# EAGLE design STHV800_pulser_board_v10 (EAGLE 9.6.2)

## Sheet 1 of 2
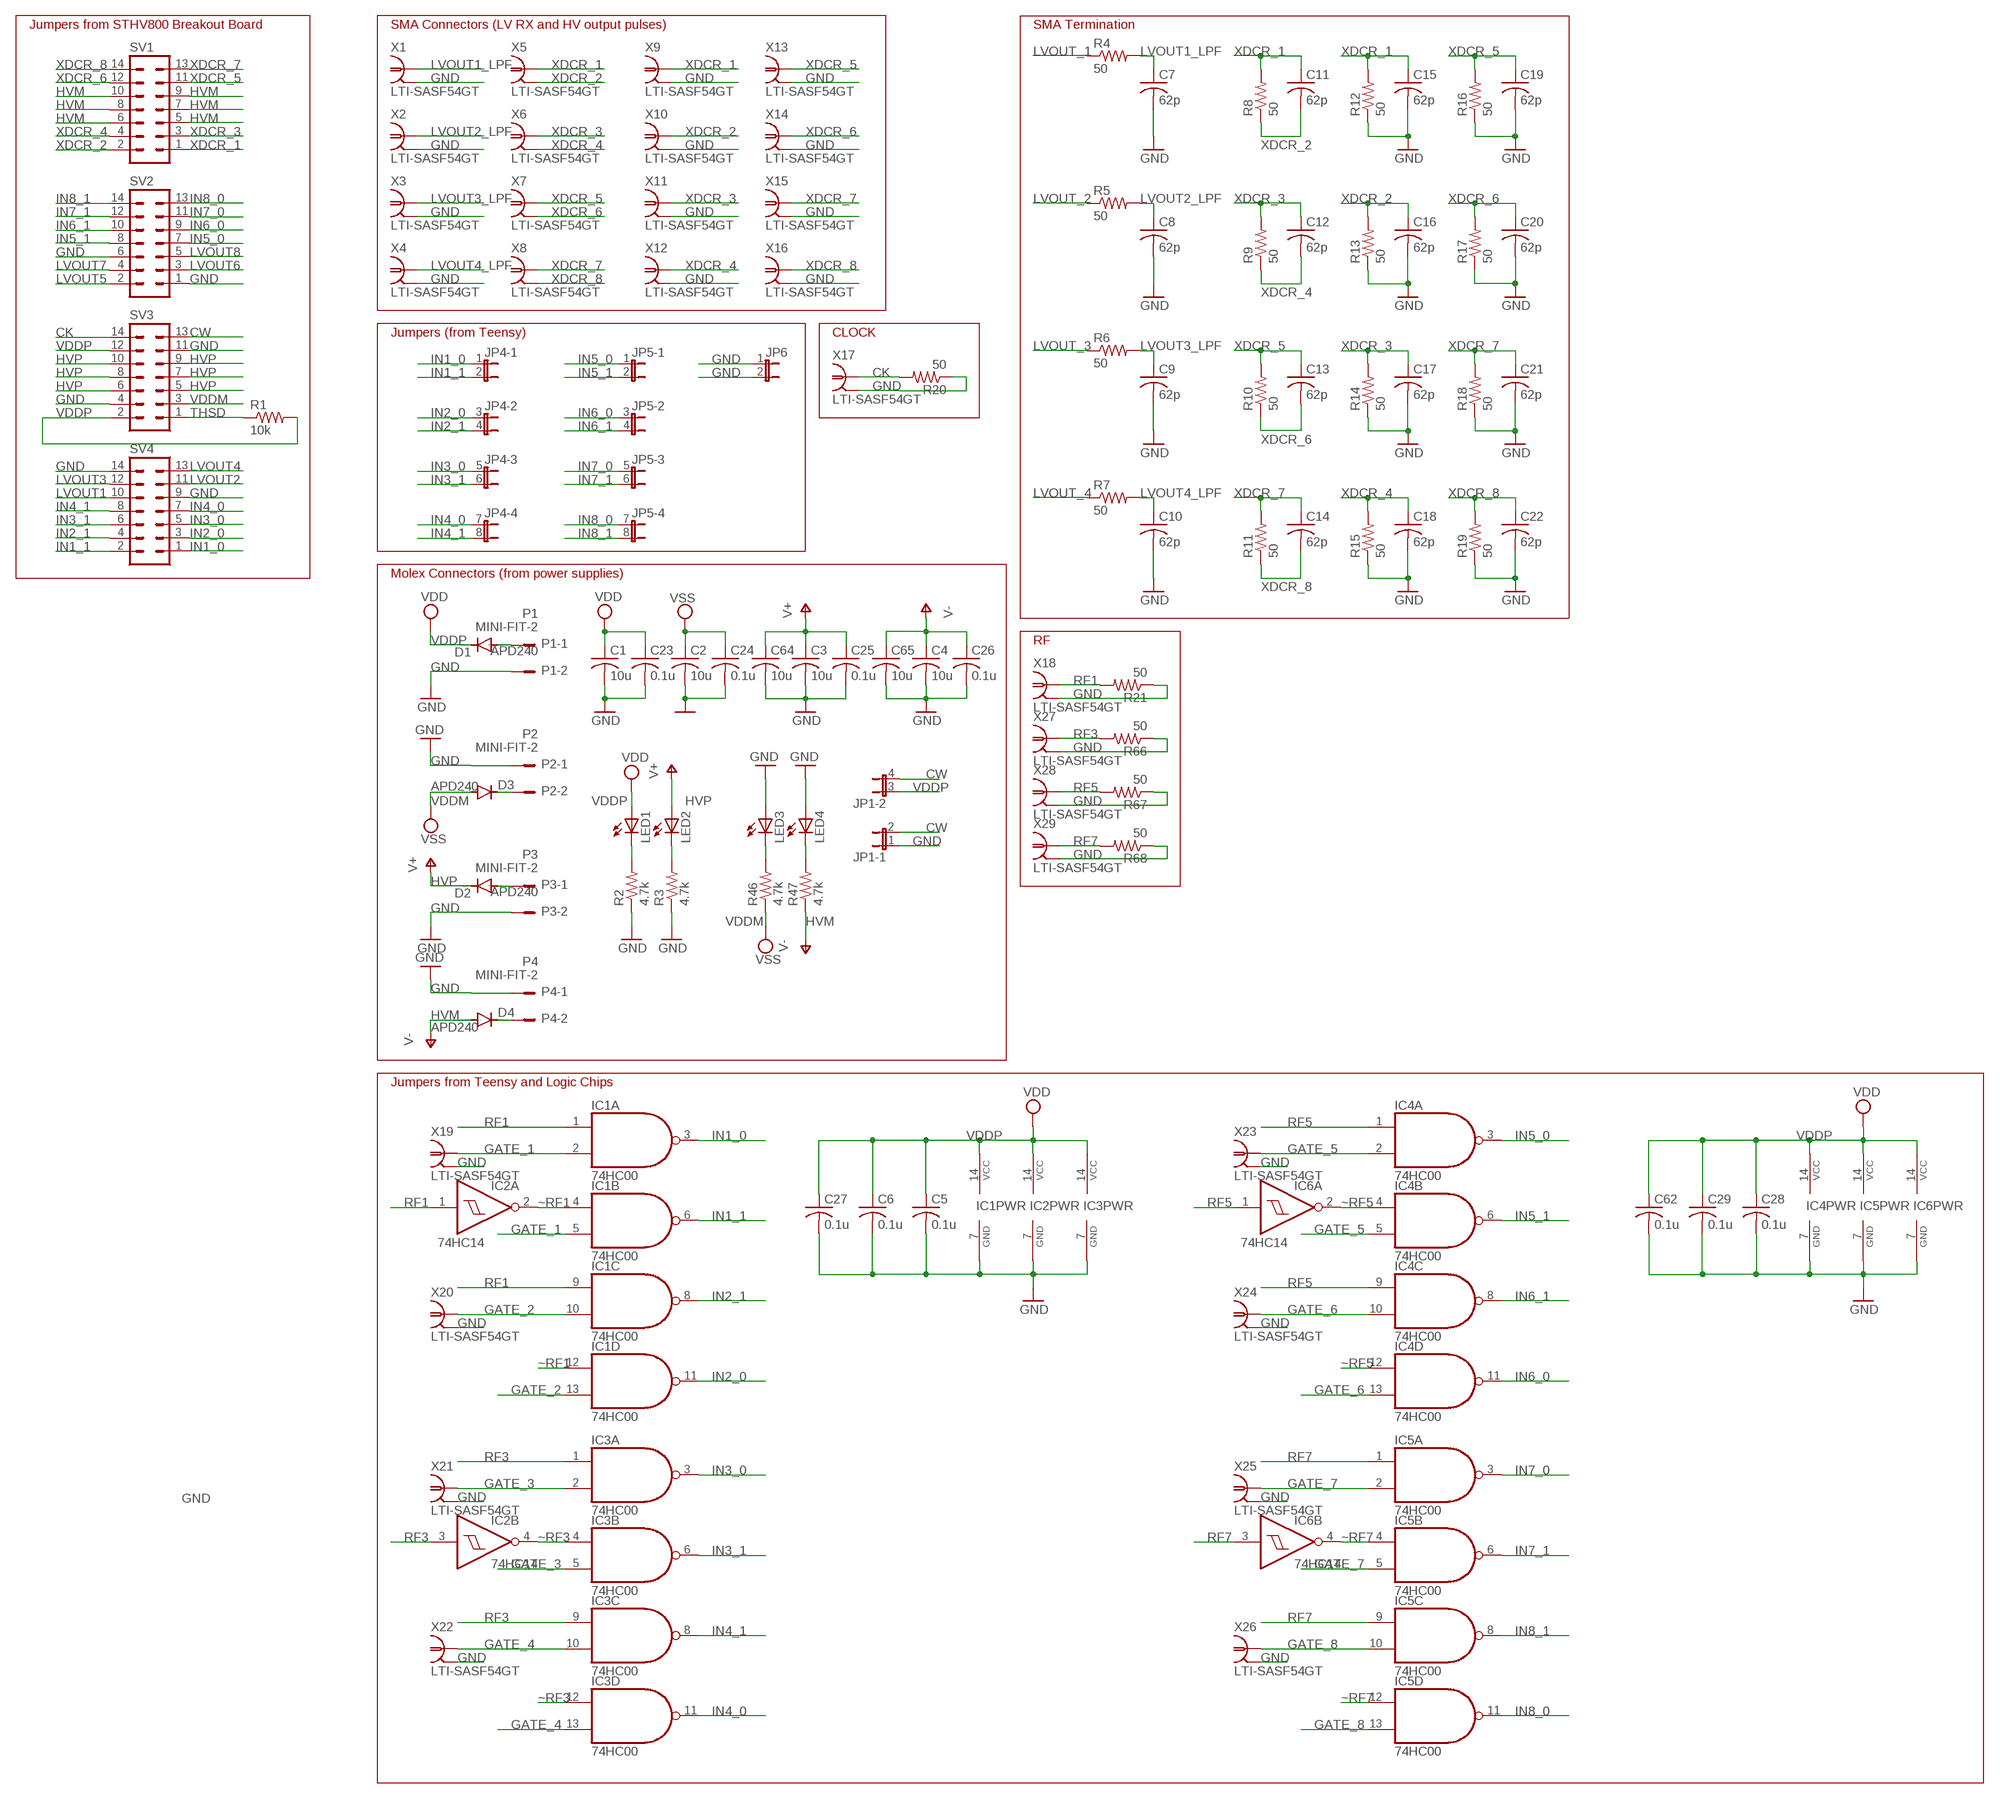
[diagram p0: schematic, sheet 1]

### Parts
C1  10u  C-USC1206  [C1206]
C2  10u  C-USC1206  [C1206]
C3  10u  C-USC1210  [C1210]
C4  10u  C-USC1210  [C1210]
C5  0.1u  C-USC0805  [C0805]
C6  0.1u  C-USC0805  [C0805]
C7  62p  C-USC0805  [C0805]
C8  62p  C-USC0805  [C0805]
C9  62p  C-USC0805  [C0805]
C10  62p  C-USC0805  [C0805]
C11  62p  C-USC0805  [C0805]
C12  62p  C-USC0805  [C0805]
C13  62p  C-USC0805  [C0805]
C14  62p  C-USC0805  [C0805]
C15  62p  C-USC0805  [C0805]
C16  62p  C-USC0805  [C0805]
C17  62p  C-USC0805  [C0805]
C18  62p  C-USC0805  [C0805]
C19  62p  C-USC0805  [C0805]
C20  62p  C-USC0805  [C0805]
C21  62p  C-USC0805  [C0805]
C22  62p  C-USC0805  [C0805]
C23  0.1u  C-USC0805  [C0805]
C24  0.1u  C-USC0805  [C0805]
C25  0.1u  C-USC0805  [C0805]
C26  0.1u  C-USC0805  [C0805]
C27  0.1u  C-USC0805  [C0805]
C28  0.1u  C-USC0805  [C0805]
C29  0.1u  C-USC0805  [C0805]
C62  0.1u  C-USC0805  [C0805]
C64  10u  C-USC1210  [C1210]
C65  10u  C-USC1210  [C1210]
D1  APD240  CGRM4001-G  [SOD-123_MINI-SMA]
D2  APD240  CGRM4001-G  [SOD-123_MINI-SMA]
D3  APD240  CGRM4001-G  [SOD-123_MINI-SMA]
D4  APD240  CGRM4001-G  [SOD-123_MINI-SMA]
IC1  74HC00  [TSSOP14]
IC2  74HC14  [TSSOP14]
IC3  74HC00  [TSSOP14]
IC4  74HC00  [TSSOP14]
IC5  74HC00  [TSSOP14]
IC6  74HC14  [TSSOP14]
JP1  JP2QE  [JP2Q]
JP4  JP4QE  [JP4Q]
JP5  JP4QE  [JP4Q]
JP6  JP1E  [JP1]
LED1  LEDSMT1206  [1206]
LED2  LEDSMT1206  [1206]
LED3  LEDSMT1206  [1206]
LED4  LEDSMT1206  [1206]
P1  MINI-FIT-2  [CON-MOLEX-MINI-FIT_39-30-?02?]
P2  MINI-FIT-2  [CON-MOLEX-MINI-FIT_39-30-?02?]
P3  MINI-FIT-2  [CON-MOLEX-MINI-FIT_39-30-?02?]
P4  MINI-FIT-2  [CON-MOLEX-MINI-FIT_39-30-?02?]
R1  10k  R-US_R0805  [R0805]
R2  4.7k  R-US_R0805  [R0805]
R3  4.7k  R-US_R0805  [R0805]
R4  50  R-US_R1206  [R1206]
R5  50  R-US_R1206  [R1206]
R6  50  R-US_R1206  [R1206]
R7  50  R-US_R1206  [R1206]
R8  50  R-US_R1206  [R1206]
R9  50  R-US_R1206  [R1206]
R10  50  R-US_R1206  [R1206]
R11  50  R-US_R1206  [R1206]
R12  50  R-US_R1206  [R1206]
R13  50  R-US_R1206  [R1206]
R14  50  R-US_R1206  [R1206]
R15  50  R-US_R1206  [R1206]
R16  50  R-US_R1206  [R1206]
R17  50  R-US_R1206  [R1206]
R18  50  R-US_R1206  [R1206]
R19  50  R-US_R1206  [R1206]
R20  50  R-US_R0805  [R0805]
R21  50  R-US_R0805  [R0805]
R46  4.7k  R-US_R0805  [R0805]
R47  4.7k  R-US_R0805  [R0805]
R66  50  R-US_R0805  [R0805]
R67  50  R-US_R0805  [R0805]
R68  50  R-US_R0805  [R0805]
SV1  MA07-2  [MA07-2]
SV2  MA07-2  [MA07-2]
SV3  MA07-2  [MA07-2]
SV4  MA07-2  [MA07-2]
X1  LTI-SASF54GT  [LTI-SASF54GT]
X2  LTI-SASF54GT  [LTI-SASF54GT]
X3  LTI-SASF54GT  [LTI-SASF54GT]
X4  LTI-SASF54GT  [LTI-SASF54GT]
X5  LTI-SASF54GT  [LTI-SASF54GT]
X6  LTI-SASF54GT  [LTI-SASF54GT]
X7  LTI-SASF54GT  [LTI-SASF54GT]
X8  LTI-SASF54GT  [LTI-SASF54GT]
X9  LTI-SASF54GT  [LTI-SASF54GT]
X10  LTI-SASF54GT  [LTI-SASF54GT]
X11  LTI-SASF54GT  [LTI-SASF54GT]
X12  LTI-SASF54GT  [LTI-SASF54GT]
X13  LTI-SASF54GT  [LTI-SASF54GT]
X14  LTI-SASF54GT  [LTI-SASF54GT]
X15  LTI-SASF54GT  [LTI-SASF54GT]
X16  LTI-SASF54GT  [LTI-SASF54GT]
X17  LTI-SASF54GT  [LTI-SASF54GT]
X18  LTI-SASF54GT  [LTI-SASF54GT]
X19  LTI-SASF54GT  [LTI-SASF54GT]
X20  LTI-SASF54GT  [LTI-SASF54GT]
X21  LTI-SASF54GT  [LTI-SASF54GT]
X22  LTI-SASF54GT  [LTI-SASF54GT]
X23  LTI-SASF54GT  [LTI-SASF54GT]
X24  LTI-SASF54GT  [LTI-SASF54GT]
X25  LTI-SASF54GT  [LTI-SASF54GT]
X26  LTI-SASF54GT  [LTI-SASF54GT]
X27  LTI-SASF54GT  [LTI-SASF54GT]
X28  LTI-SASF54GT  [LTI-SASF54GT]
X29  LTI-SASF54GT  [LTI-SASF54GT]

### Nets
CK: R20.2 SV3.14 X17.1
CW: JP1.2 JP1.4 SV3.13
GATE_1: IC1.2(A:I1) IC1.5(B:I1) X19.1
GATE_2: IC1.10(C:I1) IC1.13(D:I1) X20.1
GATE_3: IC3.2(A:I1) IC3.5(B:I1) X21.1
GATE_4: IC3.10(C:I1) IC3.13(D:I1) X22.1
GATE_5: IC4.2(A:I1) IC4.5(B:I1) X23.1
GATE_6: IC4.10(C:I1) IC4.13(D:I1) X24.1
GATE_7: IC5.2(A:I1) IC5.5(B:I1) X25.1
GATE_8: IC5.10(C:I1) IC5.13(D:I1) X26.1
GND: C1.2 C2.2 C3.2 C4.2 C5.2 C6.2 C7.2 C8.2 C9.2 C10.2 C15.2 C16.2 C17.2 C18.2 C19.2 C20.2 C21.2 C22.2 C23.2 C24.2 C25.2 C26.2 C27.2 C28.2 C29.2 C62.2 C64.2 C65.2 IC1.7(PWR:GND) IC2.7(PWR:GND) IC3.7(PWR:GND) IC4.7(PWR:GND) IC5.7(PWR:GND) IC6.7(PWR:GND) JP1.1 JP6.1 JP6.2 LED3.A LED4.A P1.2 P2.1 P3.2 P4.1 R2.1 R3.1 R12.1 R13.1 R14.1 R15.1 R16.1 R17.1 R18.1 R19.1 R20.1 R21.1 R66.1 R67.1 R68.1 SV2.1 SV2.6 SV3.4 SV3.11 SV4.9 SV4.14 X1.2 X1.3 X1.4 X1.5 X2.2 X2.3 X2.4 X2.5 X3.2 X3.3 X3.4 X3.5 X4.2 X4.3 X4.4 X4.5 X9.2 X9.3 X9.4 X9.5 X10.2 X10.3 X10.4 X10.5 X11.2 X11.3 X11.4 X11.5 X12.2 X12.3 X12.4 X12.5 X13.2 X13.3 X13.4 X13.5 X14.2 X14.3 X14.4 X14.5 X15.2 X15.3 X15.4 X15.5 X16.2 X16.3 X16.4 X16.5 X17.2 X17.3 X17.4 X17.5 X18.2 X18.3 X18.4 X18.5 X19.2 X19.3 X19.4 X19.5 X20.2 X20.3 X20.4 X20.5 X21.2 X21.3 X21.4 X21.5 X22.2 X22.3 X22.4 X22.5 X23.2 X23.3 X23.4 X23.5 X24.2 X24.3 X24.4 X24.5 X25.2 X25.3 X25.4 X25.5 X26.2 X26.3 X26.4 X26.5 X27.2 X27.3 X27.4 X27.5 X28.2 X28.3 X28.4 X28.5 X29.2 X29.3 X29.4 X29.5 ; also sheet 2
HVM: C4.1 C26.1 C65.1 D4.A R47.1 SV1.5 SV1.6 SV1.7 SV1.8 SV1.9 SV1.10 ; supply symbol labelled V-
HVP: C3.1 C25.1 C64.1 D2.C LED2.A SV3.5 SV3.6 SV3.7 SV3.8 SV3.9 SV3.10 ; supply symbol labelled V+
HVP_1: D2.A P3.1
IN1_0: IC1.3(A:O) JP4.1 SV4.1
IN1_1: IC1.6(B:O) JP4.2 SV4.2
IN2_0: IC1.11(D:O) JP4.3 SV4.3
IN2_1: IC1.8(C:O) JP4.4 SV4.4
IN3_0: IC3.3(A:O) JP4.5 SV4.5
IN3_1: IC3.6(B:O) JP4.6 SV4.6
IN4_0: IC3.11(D:O) JP4.7 SV4.7
IN4_1: IC3.8(C:O) JP4.8 SV4.8
IN5_0: IC4.3(A:O) JP5.1 SV2.7
IN5_1: IC4.6(B:O) JP5.2 SV2.8
IN6_0: IC4.11(D:O) JP5.3 SV2.9
IN6_1: IC4.8(C:O) JP5.4 SV2.10
IN7_0: IC5.3(A:O) JP5.5 SV2.11
IN7_1: IC5.6(B:O) JP5.6 SV2.12
IN8_0: IC5.11(D:O) JP5.7 SV2.13
IN8_1: IC5.8(C:O) JP5.8 SV2.14
LVOUT1: SV4.10 ; also sheet 2
LVOUT1_LPF: C7.1 R4.2 X1.1
LVOUT2: SV4.11 ; also sheet 2
LVOUT2_LPF: C8.1 R5.2 X2.1
LVOUT3: SV4.12 ; also sheet 2
LVOUT3_LPF: C9.1 R6.2 X3.1
LVOUT4: SV4.13 ; also sheet 2
LVOUT4_LPF: C10.1 R7.2 X4.1
LVOUT5: SV2.2 ; also sheet 2
LVOUT6: SV2.3 ; also sheet 2
LVOUT7: SV2.4 ; also sheet 2
LVOUT8: SV2.5 ; also sheet 2
LVOUT_1: R4.1 ; also sheet 2
LVOUT_2: R5.1 ; also sheet 2
LVOUT_3: R6.1 ; also sheet 2
LVOUT_4: R7.1 ; also sheet 2
N$1: LED1.C R2.2
N$2: LED2.C R3.2
N$11: LED3.C R46.2
N$12: LED4.C R47.2
N$13: D3.C P2.2
N$14: D4.C P4.2
RF1: IC1.1(A:I0) IC1.9(C:I0) IC2.1(A:I) R21.2 X18.1
RF3: IC2.3(B:I) IC3.1(A:I0) IC3.9(C:I0) R66.2 X27.1
RF5: IC4.1(A:I0) IC4.9(C:I0) IC6.1(A:I) R67.2 X28.1
RF7: IC5.1(A:I0) IC5.9(C:I0) IC6.3(B:I) R68.2 X29.1
THSD: R1.1 SV3.1
VDDM: C2.1 C24.1 D3.A R46.1 SV3.3 ; supply symbol labelled VSS ; also sheet 2
VDDP: C1.1 C5.1 C6.1 C23.1 C27.1 C28.1 C29.1 C62.1 D1.C IC1.14(PWR:VCC) IC2.14(PWR:VCC) IC3.14(PWR:VCC) IC4.14(PWR:VCC) IC5.14(PWR:VCC) IC6.14(PWR:VCC) JP1.3 LED1.A R1.2 SV3.2 SV3.12 ; supply symbol labelled VDD ; also sheet 2
VDDP_1: D1.A P1.1
XDCR_1: C11.1 C15.1 R8.2 R12.2 SV1.1 X5.1 X9.1
XDCR_2: C11.2 C16.1 R8.1 R13.2 SV1.2 X5.2 X5.3 X5.4 X5.5 X10.1
XDCR_3: C12.1 C17.1 R9.2 R14.2 SV1.3 X6.1 X11.1
XDCR_4: C12.2 C18.1 R9.1 R15.2 SV1.4 X6.2 X6.3 X6.4 X6.5 X12.1
XDCR_5: C13.1 C19.1 R10.2 R16.2 SV1.11 X7.1 X13.1
XDCR_6: C13.2 C20.1 R10.1 R17.2 SV1.12 X7.2 X7.3 X7.4 X7.5 X14.1
XDCR_7: C14.1 C21.1 R11.2 R18.2 SV1.13 X8.1 X15.1
XDCR_8: C14.2 C22.1 R11.1 R19.2 SV1.14 X8.2 X8.3 X8.4 X8.5 X16.1
~RF1: IC1.4(B:I0) IC1.12(D:I0) IC2.2(A:O)
~RF3: IC2.4(B:O) IC3.4(B:I0) IC3.12(D:I0)
~RF5: IC4.4(B:I0) IC4.12(D:I0) IC6.2(A:O)
~RF7: IC5.4(B:I0) IC5.12(D:I0) IC6.4(B:O)
Unconnected: IC2.5(C:I) IC2.6(C:O) IC2.8(D:O) IC2.9(D:I) IC2.10(E:O) IC2.11(E:I) IC2.12(F:O) IC2.13(F:I) IC6.5(C:I) IC6.6(C:O) IC6.8(D:O) IC6.9(D:I) IC6.10(E:O) IC6.11(E:I) IC6.12(F:O) IC6.13(F:I)

### Notes on the sheet
- Jumpers from STHV800 Breakout Board | SMA Connectors (LV RX and HV output pulses) | SMA Termination
- Jumpers (from Teensy) | CLOCK
- Molex Connectors (from power supplies)
- RF
- Jumpers from Teensy and Logic Chips

## Sheet 2 of 2
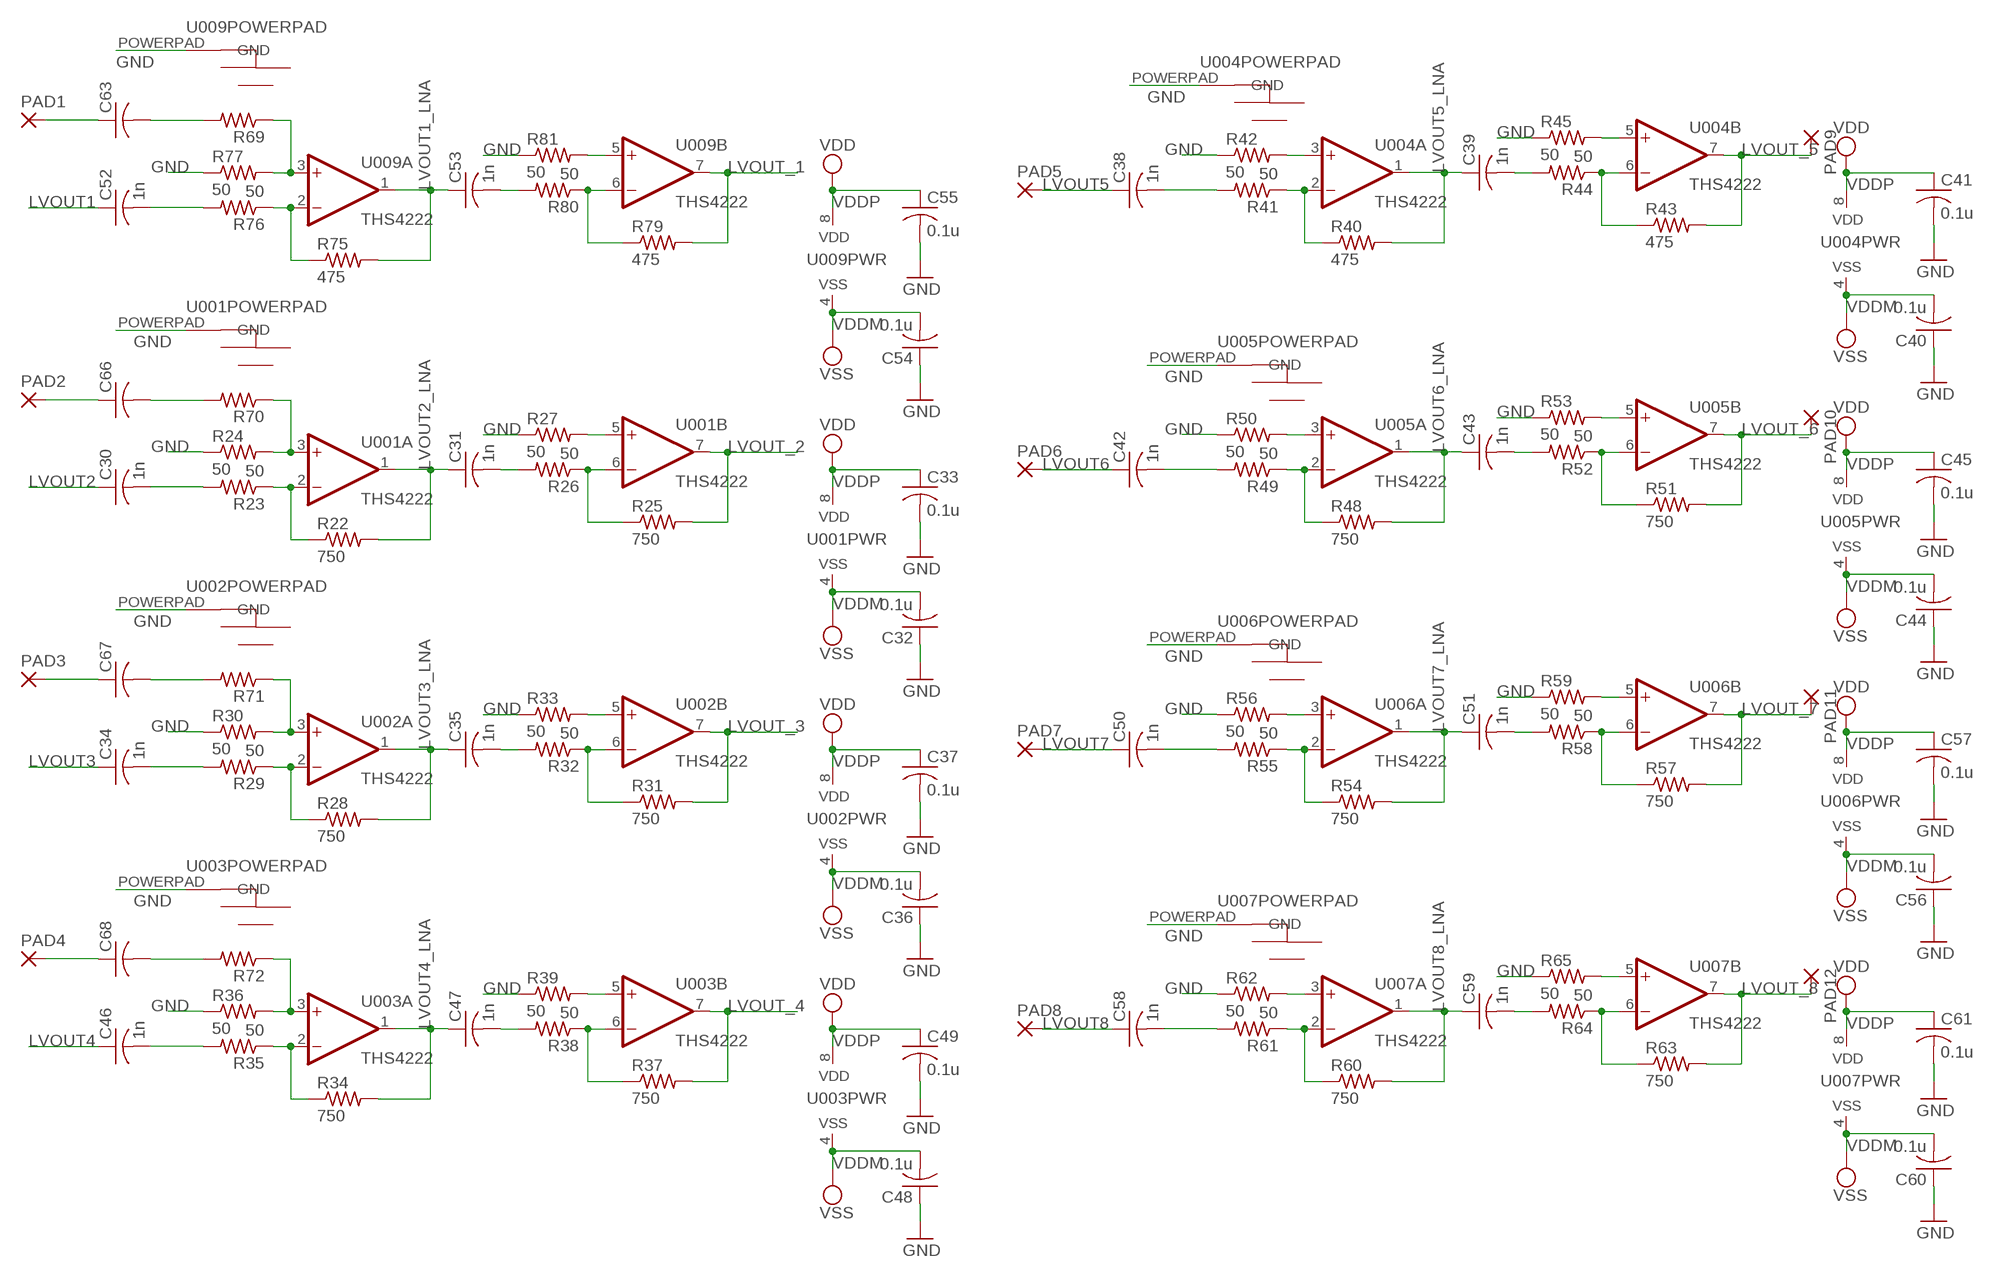
[diagram p1: schematic, sheet 2]

### Parts
C30  1n  C-USC0805  [C0805]
C31  1n  C-USC0805  [C0805]
C32  0.1u  C-USC0805  [C0805]
C33  0.1u  C-USC0805  [C0805]
C34  1n  C-USC0805  [C0805]
C35  1n  C-USC0805  [C0805]
C36  0.1u  C-USC0805  [C0805]
C37  0.1u  C-USC0805  [C0805]
C38  1n  C-USC0805  [C0805]
C39  1n  C-USC0805  [C0805]
C40  0.1u  C-USC0805  [C0805]
C41  0.1u  C-USC0805  [C0805]
C42  1n  C-USC0805  [C0805]
C43  1n  C-USC0805  [C0805]
C44  0.1u  C-USC0805  [C0805]
C45  0.1u  C-USC0805  [C0805]
C46  1n  C-USC0805  [C0805]
C47  1n  C-USC0805  [C0805]
C48  0.1u  C-USC0805  [C0805]
C49  0.1u  C-USC0805  [C0805]
C50  1n  C-USC0805  [C0805]
C51  1n  C-USC0805  [C0805]
C52  1n  C-USC0805  [C0805]
C53  1n  C-USC0805  [C0805]
C54  0.1u  C-USC0805  [C0805]
C55  0.1u  C-USC0805  [C0805]
C56  0.1u  C-USC0805  [C0805]
C57  0.1u  C-USC0805  [C0805]
C58  1n  C-USC0805  [C0805]
C59  1n  C-USC0805  [C0805]
C60  0.1u  C-USC0805  [C0805]
C61  0.1u  C-USC0805  [C0805]
C63  C-USC0805  [C0805]
C66  C-USC0805  [C0805]
C67  C-USC0805  [C0805]
C68  C-USC0805  [C0805]
PAD1  1,6/0,8  [1,6/0,8]
PAD2  1,6/0,8  [1,6/0,8]
PAD3  1,6/0,8  [1,6/0,8]
PAD4  1,6/0,8  [1,6/0,8]
PAD5  1,6/0,8  [1,6/0,8]
PAD6  1,6/0,8  [1,6/0,8]
PAD7  1,6/0,8  [1,6/0,8]
PAD8  1,6/0,8  [1,6/0,8]
PAD9  1,6/0,8  [1,6/0,8]
PAD10  1,6/0,8  [1,6/0,8]
PAD11  1,6/0,8  [1,6/0,8]
PAD12  1,6/0,8  [1,6/0,8]
R22  750  R-US_R0805  [R0805]
R23  50  R-US_R0805  [R0805]
R24  50  R-US_R0805  [R0805]
R25  750  R-US_R0805  [R0805]
R26  50  R-US_R0805  [R0805]
R27  50  R-US_R0805  [R0805]
R28  750  R-US_R0805  [R0805]
R29  50  R-US_R0805  [R0805]
R30  50  R-US_R0805  [R0805]
R31  750  R-US_R0805  [R0805]
R32  50  R-US_R0805  [R0805]
R33  50  R-US_R0805  [R0805]
R34  750  R-US_R0805  [R0805]
R35  50  R-US_R0805  [R0805]
R36  50  R-US_R0805  [R0805]
R37  750  R-US_R0805  [R0805]
R38  50  R-US_R0805  [R0805]
R39  50  R-US_R0805  [R0805]
R40  475  R-US_R0805  [R0805]
R41  50  R-US_R0805  [R0805]
R42  50  R-US_R0805  [R0805]
R43  475  R-US_R0805  [R0805]
R44  50  R-US_R0805  [R0805]
R45  50  R-US_R0805  [R0805]
R48  750  R-US_R0805  [R0805]
R49  50  R-US_R0805  [R0805]
R50  50  R-US_R0805  [R0805]
R51  750  R-US_R0805  [R0805]
R52  50  R-US_R0805  [R0805]
R53  50  R-US_R0805  [R0805]
R54  750  R-US_R0805  [R0805]
R55  50  R-US_R0805  [R0805]
R56  50  R-US_R0805  [R0805]
R57  750  R-US_R0805  [R0805]
R58  50  R-US_R0805  [R0805]
R59  50  R-US_R0805  [R0805]
R60  750  R-US_R0805  [R0805]
R61  50  R-US_R0805  [R0805]
R62  50  R-US_R0805  [R0805]
R63  750  R-US_R0805  [R0805]
R64  50  R-US_R0805  [R0805]
R65  50  R-US_R0805  [R0805]
R69  R-US_R0805  [R0805]
R70  R-US_R0805  [R0805]
R71  R-US_R0805  [R0805]
R72  R-US_R0805  [R0805]
R75  475  R-US_R0805  [R0805]
R76  50  R-US_R0805  [R0805]
R77  50  R-US_R0805  [R0805]
R79  475  R-US_R0805  [R0805]
R80  50  R-US_R0805  [R0805]
R81  50  R-US_R0805  [R0805]
U001  THS4222  [SSOP08-POWERPAD]
U002  THS4222  [SSOP08-POWERPAD]
U003  THS4222  [SSOP08-POWERPAD]
U004  THS4222  [SSOP08-POWERPAD]
U005  THS4222  [SSOP08-POWERPAD]
U006  THS4222  [SSOP08-POWERPAD]
U007  THS4222  [SSOP08-POWERPAD]
U009  THS4222  [SSOP08-POWERPAD]

### Nets
GND: C32.1 C33.2 C36.1 C37.2 C40.1 C41.2 C44.1 C45.2 C48.1 C49.2 C54.1 C55.2 C56.1 C57.2 C60.1 C61.2 R24.1 R27.1 R30.1 R33.1 R36.1 R39.1 R42.1 R45.1 R50.1 R53.1 R56.1 R59.1 R62.1 R65.1 R77.1 R81.1 U001.POWERPAD(POWERPAD:GND) U002.POWERPAD(POWERPAD:GND) U003.POWERPAD(POWERPAD:GND) U004.POWERPAD(POWERPAD:GND) U005.POWERPAD(POWERPAD:GND) U006.POWERPAD(POWERPAD:GND) U007.POWERPAD(POWERPAD:GND) U009.POWERPAD(POWERPAD:GND) ; also sheet 1
LVOUT1: C52.1 ; also sheet 1
LVOUT1_LNA: C53.1 R75.2 U009.1(A:OUT)
LVOUT2: C30.1 ; also sheet 1
LVOUT2_LNA: C31.1 R22.2 U001.1(A:OUT)
LVOUT3: C34.1 ; also sheet 1
LVOUT3_LNA: C35.1 R28.2 U002.1(A:OUT)
LVOUT4: C46.1 ; also sheet 1
LVOUT4_LNA: C47.1 R34.2 U003.1(A:OUT)
LVOUT5: C38.1 PAD5.1(P) ; also sheet 1
LVOUT5_LNA: C39.1 R40.2 U004.1(A:OUT)
LVOUT6: C42.1 PAD6.1(P) ; also sheet 1
LVOUT6_LNA: C43.1 R48.2 U005.1(A:OUT)
LVOUT7: C50.1 PAD7.1(P) ; also sheet 1
LVOUT7_LNA: C51.1 R54.2 U006.1(A:OUT)
LVOUT8: C58.1 PAD8.1(P) ; also sheet 1
LVOUT8_LNA: C59.1 R60.2 U007.1(A:OUT)
LVOUT_1: R79.2 U009.7(B:OUT) ; also sheet 1
LVOUT_2: R25.2 U001.7(B:OUT) ; also sheet 1
LVOUT_3: R31.2 U002.7(B:OUT) ; also sheet 1
LVOUT_4: R37.2 U003.7(B:OUT) ; also sheet 1
LVOUT_5: PAD9.1(P) R43.2 U004.7(B:OUT)
LVOUT_6: PAD10.1(P) R51.2 U005.7(B:OUT)
LVOUT_7: PAD11.1(P) R57.2 U006.7(B:OUT)
LVOUT_8: PAD12.1(P) R63.2 U007.7(B:OUT)
N$3: R25.1 R26.1 U001.6(B:-IN)
N$4: R24.2 R70.1 U001.3(A:+IN)
N$5: R22.1 R23.1 U001.2(A:-IN)
N$6: C30.2 R23.2
N$7: C31.2 R26.2
N$8: R27.2 U001.5(B:+IN)
N$9: R31.1 R32.1 U002.6(B:-IN)
N$15: R30.2 R71.1 U002.3(A:+IN)
N$16: R43.1 R44.1 U004.6(B:-IN)
N$17: R42.2 U004.3(A:+IN)
N$18: R40.1 R41.1 U004.2(A:-IN)
N$19: C38.2 R41.2
N$20: C39.2 R44.2
N$21: R45.2 U004.5(B:+IN)
N$22: R51.1 R52.1 U005.6(B:-IN)
N$23: R28.1 R29.1 U002.2(A:-IN)
N$24: C34.2 R29.2
N$25: C35.2 R32.2
N$26: R33.2 U002.5(B:+IN)
N$27: R37.1 R38.1 U003.6(B:-IN)
N$28: R36.2 R72.1 U003.3(A:+IN)
N$29: R34.1 R35.1 U003.2(A:-IN)
N$30: C46.2 R35.2
N$31: C47.2 R38.2
N$32: R39.2 U003.5(B:+IN)
N$33: R50.2 U005.3(A:+IN)
N$34: R48.1 R49.1 U005.2(A:-IN)
N$35: C42.2 R49.2
N$36: C43.2 R52.2
N$37: R53.2 U005.5(B:+IN)
N$38: R57.1 R58.1 U006.6(B:-IN)
N$39: R56.2 U006.3(A:+IN)
N$40: R54.1 R55.1 U006.2(A:-IN)
N$41: C50.2 R55.2
N$42: C51.2 R58.2
N$43: R59.2 U006.5(B:+IN)
N$44: R63.1 R64.1 U007.6(B:-IN)
N$45: R62.2 U007.3(A:+IN)
N$46: R60.1 R61.1 U007.2(A:-IN)
N$47: C58.2 R61.2
N$48: C59.2 R64.2
N$49: R65.2 U007.5(B:+IN)
N$50: C63.2 R69.2
N$51: C67.2 R71.2
N$52: C66.2 R70.2
N$54: C68.2 R72.2
N$58: R79.1 R80.1 U009.6(B:-IN)
N$59: R69.1 R77.2 U009.3(A:+IN)
N$60: R75.1 R76.1 U009.2(A:-IN)
N$61: C52.2 R76.2
N$62: C53.2 R80.2
N$63: R81.2 U009.5(B:+IN)
TEST_VIA_1: C63.1 PAD1.1(P)
TEST_VIA_2: C66.1 PAD2.1(P)
TEST_VIA_3: C67.1 PAD3.1(P)
TEST_VIA_4: C68.1 PAD4.1(P)
VDDM: C32.2 C36.2 C40.2 C44.2 C48.2 C54.2 C56.2 C60.2 U001.4(PWR:VSS) U002.4(PWR:VSS) U003.4(PWR:VSS) U004.4(PWR:VSS) U005.4(PWR:VSS) U006.4(PWR:VSS) U007.4(PWR:VSS) U009.4(PWR:VSS) ; supply symbol labelled VSS ; also sheet 1
VDDP: C33.1 C37.1 C41.1 C45.1 C49.1 C55.1 C57.1 C61.1 U001.8(PWR:VDD) U002.8(PWR:VDD) U003.8(PWR:VDD) U004.8(PWR:VDD) U005.8(PWR:VDD) U006.8(PWR:VDD) U007.8(PWR:VDD) U009.8(PWR:VDD) ; supply symbol labelled VDD ; also sheet 1

## Library data of the parts
C1-C68 = rcl:C-US: CAPACITOR, American symbol; SPICEPREFIX: C
D1-D4 = diode:CGRM400*-G: Molded plasitc,JEDEC SOD-123/Mini SMA Source: Comchip CGRM4001-G.pdf
IC1 IC3-IC5 = STHV800_components:74HC00
IC2 IC6 = STHV800_components:74HC14
JP1 = jumper:JP2QE: JUMPER
JP4 JP5 = jumper:JP4QE: JUMPER
JP6 = jumper:JP1E: JUMPER
LED1-LED4 = led:LED: LED OSRAM: - CHIPLED LG R971, LG N971, LY N971, LG Q971, LY Q971, LO R971, LY R971 LH N974, LH R974 LS Q976, LO Q976, LY Q976 LO Q996 - Hyper CHIPLED LW Q18S LB Q993, LB Q99A, LB R99A - SideLED LS A670, LO A670, LY A670, LG A670, LP A670 LB A673, LV A673, LT A673, LW A673 LH A674 LY A675 LS A676, LA A676, LO A676, LY A676, LW A676 LS A679, LY A679, LG A679 - Hyper Micro SIDELED® LS Y876, LA Y876, LO Y876, LY Y876 LT Y87S - SmartLED LW L88C, LW L88S LB L89C, LB L89S, LG L890 LS L89K, LO L89K, LY L89K LS L896, LA L896, LO L896, LY L896 - TOPLED LS T670, LO T670, LY T670, LG T670, LP T670 LSG T670, LSP T670, LSY T670, LOP T670, LYG T670 LG T671, LOG T671, LSG T671 LB T673, LV T673, LT T673, LW T673 LH T674 LS T676, LA T676, LO T676, LY T676, LB T676, LH T676, LSB T676, LW T676 LB T67C, LV T67C, LT T67C, LS T67K, LO T67K, LY T67K, LW E67C LS E67B, LA E67B, LO E67B, LY E67B, LB E67C, LV E67C, LT E67C LW T67C LS T679, LY T679, LG T679 LS T770, LO T770, LY T770, LG T770, LP T770 LB T773, LV T773, LT T773, LW T773 LH T774 LS E675, LA E675, LY E675, LS T675 LS T776, LA T776, LO T776, LY T776, LB T776 LHGB T686 LT T68C, LB T68C - Hyper Mini TOPLED® LB M676 - Mini TOPLED Santana® LG M470 LS M47K, LO M47K, LY M47K Source: http://www.osram.convergy.de LUXEON: - LUMILED® LXK2-PW12-R00, LXK2-PW12-S00, LXK2-PW14-U00, LXK2-PW14-V00 LXK2-PM12-R00, LXK2-PM12-S00, LXK2-PM14-U00 LXK2-PE12-Q00, LXK2-PE12-R00, LXK2-PE12-S00, LXK2-PE14-T00, LXK2-PE14-U00 LXK2-PB12-K00, LXK2-PB12-L00, LXK2-PB12-M00, LXK2-PB14-N00, LXK2-PB14-P00, LXK2-PB14-Q00 LXK2-PR12-L00, LXK2-PR12-M00, LXK2-PR14-Q00, LXK2-PR14-R00 LXK2-PD12-Q00, LXK2-PD12-R00, LXK2-PD12-S00 LXK2-PH12-R00, LXK2-PH12-S00 LXK2-PL12-P00, LXK2-PL12-Q00, LXK2-PL12-R00 Source: www.luxeon.com KINGBRIGHT: KA-3528ASYC Source: www.kingbright.com
P1-P4 = molex-mini-fit-jr:MINI-FIT-2: HEADER
PAD1-PAD12 = wirepad:1,6/0,8: THROUGH-HOLE PAD
R1-R72 R75-R77 R79-R81 = rcl:R-US_: RESISTOR, American symbol; SPICEPREFIX: R
SV1-SV4 = con-lstb:MA07-2: PIN HEADER; OC_FARNELL: unknown; OC_NEWARK: unknown
U001-U007 U009 = STHV800_components:THS4222
X1-X29 = con-coax:LTI-SASF54GT: SMA vertical PCB thrue hole jack Source: Lighthorse Technologies, inc. SASF54GT.pdf; OC_FARNELL: unknown; OC_NEWARK: unknown

## Board
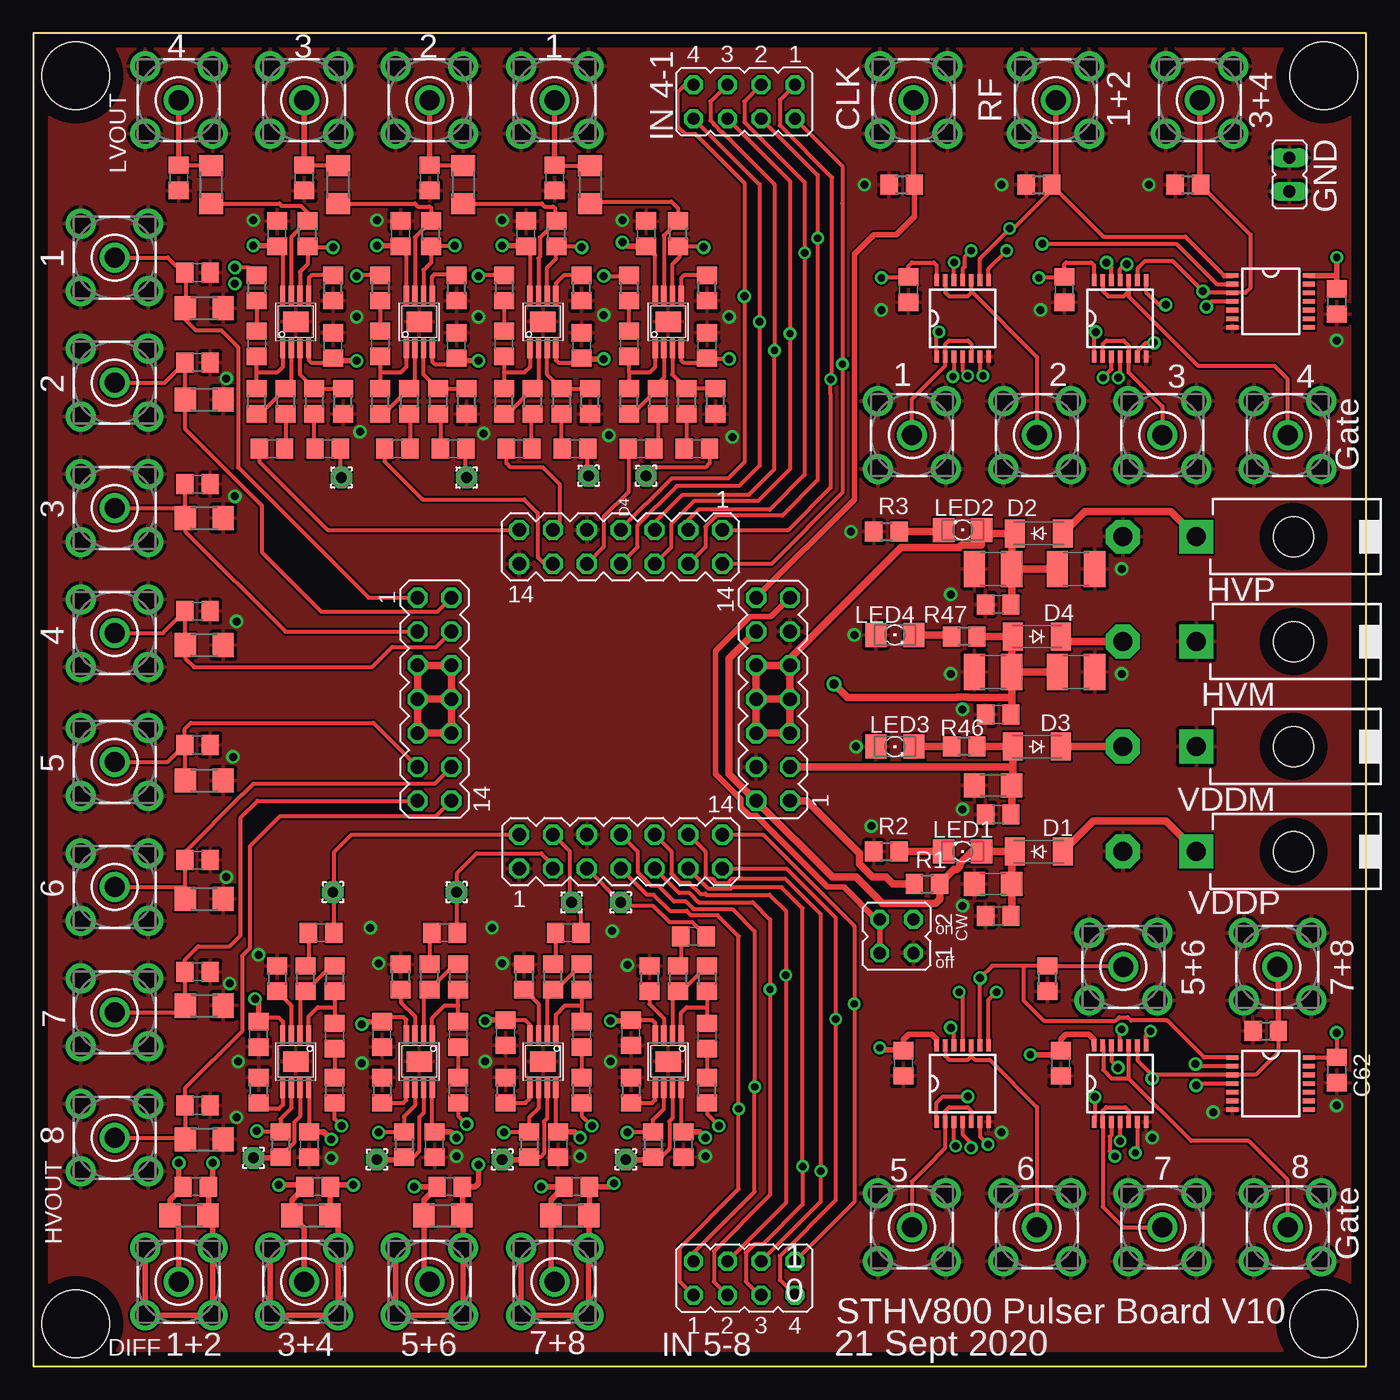
[diagram p2: board, top side]
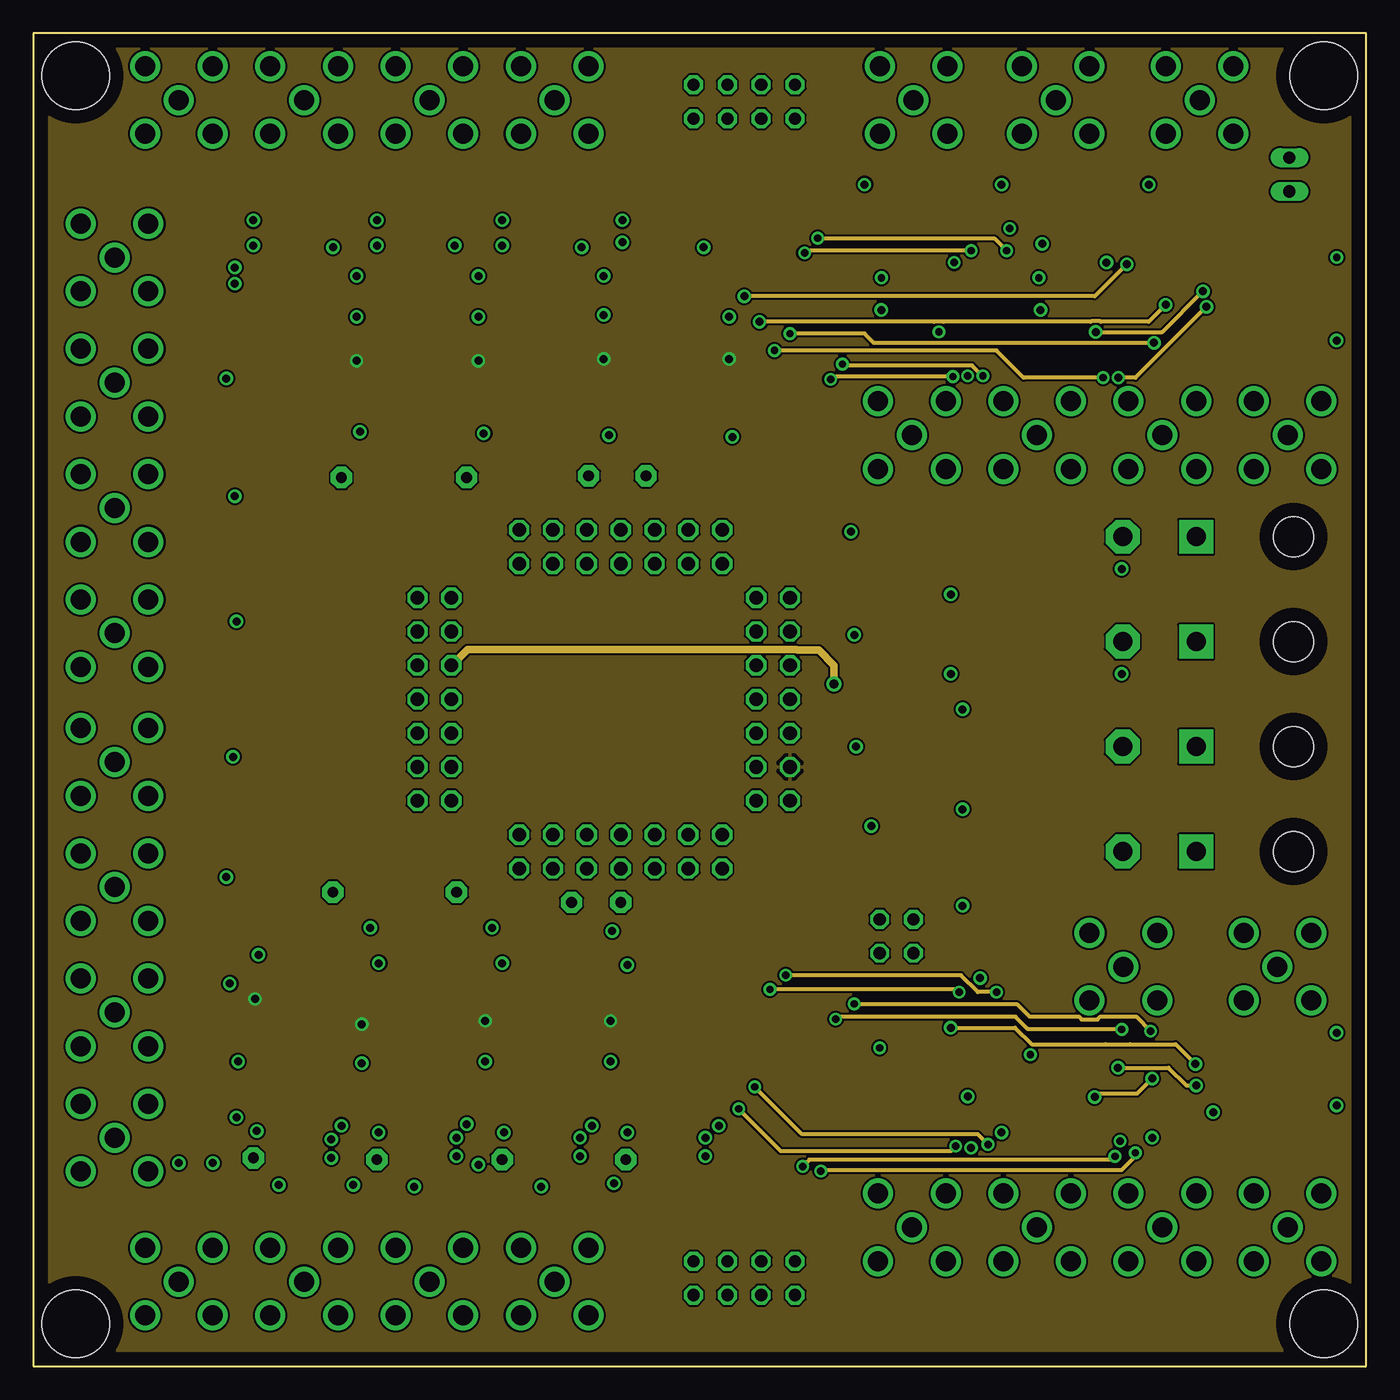
[diagram p3: board, inner layer VDDM]
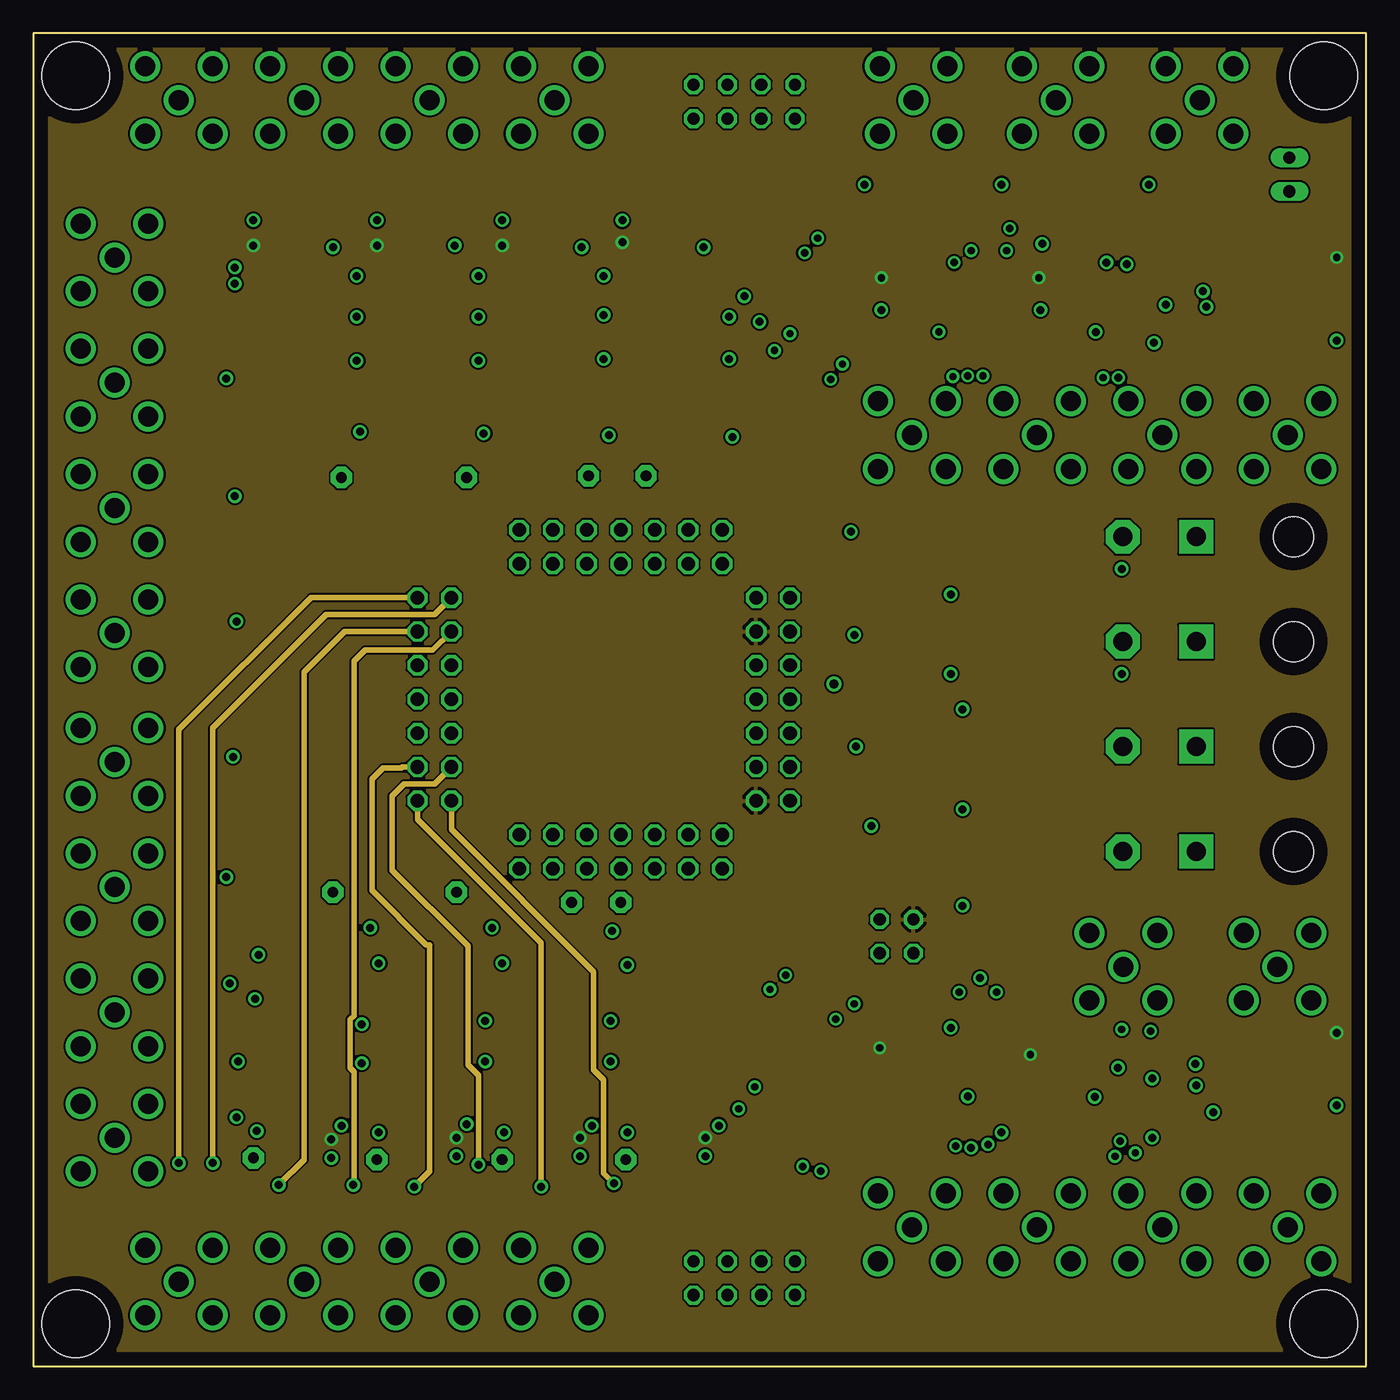
[diagram p4: board, inner layer VDDP]
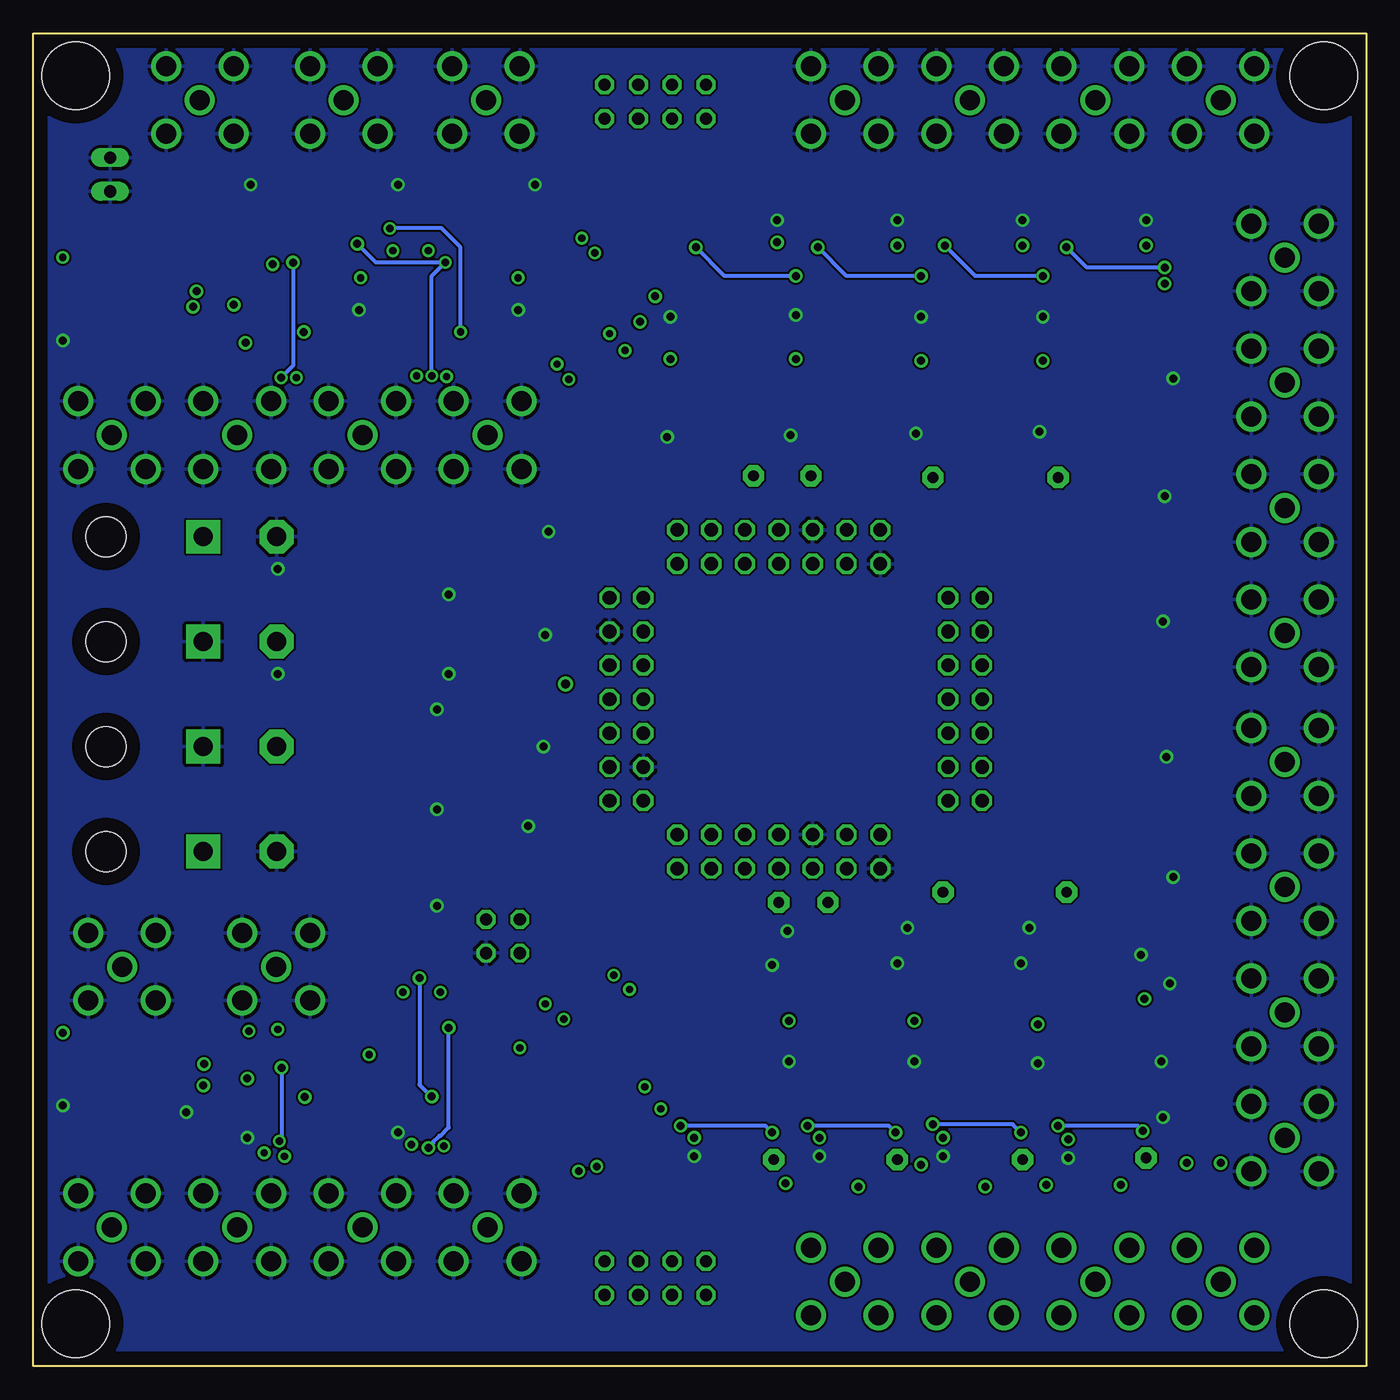
[diagram p5: board, bottom side, seen from below]

Size 100 x 100 mm. Coordinates in mm from the lower left corner, seen from the top.
Outline: 0,100 0,0 100,0 100,100 0,100
Copper layers (1+2*15+16): Top 0.035mm / dielectric 0.5mm / VDDM 0.035mm / dielectric 0.5mm / VDDP 0.035mm / dielectric 0.5mm / Bottom 0.035mm
Design rules "default *": minimum track width 6mil, minimum drill 0.35mm, track to track 6mil, track to pad 6mil, pad to pad 6mil, via to via 6mil, smd to smd 6mil, copper to edge 40mil, drill to drill 6mil, minimum pad ring 10mil, minimum via ring 8mil, stop-mask expansion 4mil, vias tented up to drill 0mil, thermal gap 10mil
Holes 5.08 mm at 3.17,96.83 3.17,3.17 96.83,3.17 96.83,96.83

### Footprints (pad centres in the part's own frame; a part is rotated, then mirrored left to right if it is on the bottom)
C1206 = smd 1.6 x 1.8: 1 -1.4,0; 2 1.4,0
C1210 = smd 1.6 x 2.7: 1 -1.4,0; 2 1.4,0
C0805 = smd 1.3 x 1.5: 1 -0.95,0; 2 0.95,0
SOD-123_MINI-SMA = smd 1.5 x 2.1: A 1.8,0; C -1.8,0
TSSOP14 = smd 0.9 x 0.35: 1 -2.875,1.95; 2 -2.875,1.3; 3 -2.875,0.65; 4 -2.875,0; 5 -2.875,-0.65; 6 -2.875,-1.3; 7 -2.875,-1.95; 8 2.875,-1.95; 9 2.875,-1.3; 10 2.875,-0.65; 11 2.875,0; 12 2.875,0.65; 13 2.875,1.3; 14 2.875,1.95
JP2Q = drill 0.914 octagon: 1 -1.27,-1.27; 2 -1.27,1.27; 3 1.27,-1.27; 4 1.27,1.27
JP4Q = drill 0.914 octagon: 1 -3.81,-1.27; 2 -3.81,1.27; 3 -1.27,-1.27; 4 -1.27,1.27; 5 1.27,-1.27; 6 1.27,1.27; 7 3.81,-1.27; 8 3.81,1.27
JP1 = drill 0.914 long: 1 0,-1.27; 2 0,1.27
1206 = smd 1.6 x 1.803: A -1.422,0; C 1.422,0
CON-MOLEX-MINI-FIT_39-30-?02? = drill 1.422 pad 2.54 square: 1 0,0 | drill 1.422 pad 2.54 octagon: 2 0,5.512 | hole 3: 0,-7.3
1,6/0,8 = drill 0.813 pad 1.6 octagon: 1 0,0
R0805 = smd 1.3 x 1.5: 1 -0.95,0; 2 0.95,0
R1206 = smd 1.6 x 1.803: 1 -1.422,0; 2 1.422,0
MA07-2 = drill 1.016 octagon: 1 -7.62,-1.27; 2 -7.62,1.27; 3 -5.08,-1.27; 4 -5.08,1.27; 5 -2.54,-1.27; 6 -2.54,1.27; 7 0,-1.27; 8 0,1.27; 9 2.54,-1.27; 10 2.54,1.27; 11 5.08,-1.27; 12 5.08,1.27; 13 7.62,-1.27; 14 7.62,1.27
SSOP08-POWERPAD = smd 0.4 x 1.45: 1 -0.975,-2; 2 -0.325,-2; 3 0.325,-2; 4 0.975,-2; 5 0.975,2; 6 0.325,2; 7 -0.325,2; 8 -0.975,2 | smd 1.905 x 1.524: POWERPAD 0,0
LTI-SASF54GT = drill 1.5 pad 2.2: 1 0,0; 2 -2.54,2.54; 3 2.54,2.54; 4 2.54,-2.54; 5 -2.54,-2.54

### Placement (x,y rotation side)
C1  72.01,36.2 180 top
C2  72.01,43.56 180 top
C3  72.01,59.82 180 top
C4  72.01,52.07 180 top
C5  65.66,80.77 270 top
C6  97.79,79.88 270 top
C7  39.12,89.15 270 top
C8  29.72,89.15 270 top
C9  20.32,89.15 270 top
C10  10.92,89.15 270 top
C11  12.19,13.46 0 top
C12  21.34,13.46 0 top
C13  31.24,13.46 0 top
C14  40.77,13.46 0 top
C15  12.32,82.04 0 top
C16  12.32,75.31 0 top
C17  12.32,66.17 0 top
C18  12.32,56.64 0 top
C19  12.32,46.61 0 top
C20  12.32,37.97 0 top
C21  12.32,29.59 0 top
C22  12.32,19.56 0 top
C23  72.39,33.78 180 top
C24  72.39,41.4 180 top
C25  72.39,57.15 180 top
C26  72.39,48.9 180 top
C27  77.34,80.77 270 top
C28  65.28,22.73 270 top
C29  77.09,22.73 270 top
C30  36.45,68.83 0 top
C31  35.31,76.71 90 top
C32  41.15,76.58 270 top
C33  36.96,84.96 90 top
C34  27.3,68.83 0 top
C35  26.04,76.71 90 top
C36  31.75,76.58 270 top
C37  27.56,84.96 90 top
C38  21.59,32.51 180 top
C39  22.61,24.77 270 top
C40  16.89,24.89 90 top
C41  20.7,16.64 270 top
C42  30.86,32.51 180 top
C43  31.88,24.89 270 top
C44  26.16,24.89 90 top
C45  30.1,16.64 270 top
C46  17.91,68.83 0 top
C47  16.76,76.71 90 top
C48  22.48,76.58 270 top
C49  18.29,84.96 90 top
C50  40.13,32.51 180 top
C51  41.15,24.89 270 top
C52  45.59,68.83 0 top
C53  44.7,76.71 90 top
C54  50.55,76.58 270 top
C55  45.97,84.96 90 top
C56  35.43,25.02 90 top
C57  39.37,16.64 270 top
C58  49.53,32.26 180 top
C59  50.55,24.77 270 top
C60  44.83,25.02 90 top
C61  48.77,16.64 270 top
C62  97.79,22.23 270 top
C63  49.78,68.83 180 top
C64  78.23,59.82 0 top
C65  78.23,52.07 0 top
C66  40.64,68.83 180 top
C67  31.5,68.83 180 top
C68  22.1,68.83 180 top
D1  75.44,38.61 0 top
D2  75.44,62.48 0 top
D3  75.31,46.48 180 top
D4  75.31,54.74 180 top
IC1  69.72,78.61 90 top
IC2  92.84,79.88 0 top
IC3  81.53,78.61 90 top
IC4  69.72,21.21 90 top
IC5  81.53,21.21 90 top
IC6  92.84,21.21 0 top
JP1  64.77,32.26 90 top
JP4  53.34,94.87 180 top
JP5  53.34,6.6 0 top
JP6  94.23,89.41 0 top
LED1  69.72,38.61 180 top
LED2  69.72,62.74 180 top
LED3  64.64,46.48 0 top
LED4  64.64,54.86 0 top
P1  87.25,38.61 90 top
P2  87.25,46.48 90 top
P3  87.25,62.23 90 top
P4  87.25,54.36 90 top
PAD1  45.97,66.8 0 top
PAD2  41.66,66.8 0 top
PAD3  32.51,66.67 0 top
PAD4  23.11,66.67 0 top
PAD5  22.48,35.56 0 top
PAD6  31.75,35.56 0 top
PAD7  40.39,34.8 0 top
PAD8  44.07,34.8 0 top
PAD9  16.51,15.62 0 top
PAD10  25.78,15.49 0 top
PAD11  35.18,15.49 0 top
PAD12  44.45,15.49 0 top
R1  67.06,36.2 0 top
R2  64.01,38.61 0 top
R3  64.01,62.61 0 top
R4  41.78,88.65 90 top
R5  32.26,88.65 90 top
R6  22.86,88.65 90 top
R7  13.34,88.65 90 top
R8  11.68,11.3 180 top
R9  20.83,11.3 180 top
R10  30.73,11.3 180 top
R11  40.26,11.3 180 top
R12  12.83,79.38 180 top
R13  12.83,72.52 180 top
R14  12.83,63.63 180 top
R15  12.83,54.1 180 top
R16  12.83,43.94 180 top
R17  12.83,35.05 180 top
R18  12.83,27.05 180 top
R19  12.83,17.02 180 top
R20  65.15,88.65 0 top
R21  75.44,88.65 0 top
R22  35.31,72.39 90 top
R23  37.47,72.39 270 top
R24  41.78,72.39 90 top
R25  39.24,84.96 90 top
R26  35.31,80.9 270 top
R27  41.15,80.9 90 top
R28  26.04,72.39 90 top
R29  28.19,72.39 270 top
R30  32.51,72.39 90 top
R31  29.84,84.96 90 top
R32  26.04,80.9 270 top
R33  31.75,80.9 90 top
R34  16.76,72.39 90 top
R35  18.92,72.39 270 top
R36  23.24,72.39 90 top
R37  20.57,84.96 90 top
R38  16.76,80.9 270 top
R39  22.48,80.9 90 top
R40  22.61,29.08 270 top
R41  20.45,29.08 90 top
R42  18.29,29.08 270 top
R43  18.54,16.64 270 top
R44  22.61,20.7 90 top
R45  16.89,20.7 270 top
R46  69.85,46.48 180 top
R47  69.85,54.74 180 top
R48  31.88,29.21 270 top
R49  29.72,29.21 90 top
R50  27.56,29.21 270 top
R51  27.81,16.64 270 top
R52  31.88,20.7 90 top
R53  26.16,20.7 270 top
R54  41.15,29.21 270 top
R55  38.99,29.21 90 top
R56  36.83,29.21 270 top
R57  37.21,16.64 270 top
R58  41.15,20.7 90 top
R59  35.43,20.7 270 top
R60  50.55,29.08 270 top
R61  48.39,29.08 90 top
R62  46.23,29.08 270 top
R63  46.48,16.64 270 top
R64  50.55,20.7 90 top
R65  44.83,20.7 270 top
R66  86.61,88.65 0 top
R67  76.07,29.08 90 top
R68  92.46,25.15 0 top
R69  49.02,72.39 270 top
R70  39.62,72.39 270 top
R71  30.35,72.39 270 top
R72  21.08,72.39 270 top
R75  44.7,72.39 90 top
R76  46.86,72.39 270 top
R77  51.18,72.39 90 top
R79  48.39,84.96 90 top
R80  44.7,80.9 270 top
R81  50.55,80.9 90 top
SV1  30.1,50.04 270 top
SV2  44.07,38.61 0 top
SV3  55.5,50.04 90 top
SV4  44.07,61.47 180 top
U001  38.23,78.36 0 top
U002  28.96,78.36 0 top
U003  19.68,78.36 0 top
U004  19.68,22.86 180 top
U005  28.96,22.86 180 top
U006  38.23,22.86 180 top
U007  47.62,22.86 180 top
U009  47.62,78.36 0 top
X1  39.12,95 0 top
X2  29.72,95 0 top
X3  20.32,95 0 top
X4  10.92,95 0 top
X5  10.92,6.35 180 top
X6  20.32,6.35 180 top
X7  29.72,6.35 180 top
X8  39.12,6.35 180 top
X9  6.1,83.19 90 top
X10  6.1,73.79 90 top
X11  6.1,64.39 90 top
X12  6.1,54.99 90 top
X13  6.1,45.34 90 top
X14  6.1,35.94 90 top
X15  6.1,26.54 90 top
X16  6.1,17.14 90 top
X17  66.04,95 180 top
X18  76.71,95 180 top
X19  65.91,69.85 0 top
X20  75.31,69.85 0 top
X21  84.71,69.85 0 top
X22  94.11,69.85 0 top
X23  65.91,10.41 0 top
X24  75.31,10.41 0 top
X25  84.71,10.41 0 top
X26  94.11,10.41 0 top
X27  87.5,95 0 top
X28  81.79,29.97 0 top
X29  93.34,29.97 0 top

### Tracks (layer width: path | path; a pad name or v marks a point on that pad's centre or on a via)
CK
  Top 0.406: SV3.14 61.59,65.02 61.59,83.44 63.06,84.9 64.77,84.9 66.1,86.23 R20.2 66.04,88.71 X17.1
CW
  Top 0.406: SV3.13 55.35,56.24 53.77,56.24 51.18,53.65 51.18,44.45 53.11,42.52 53.11,41.95 53.77,41.3 54.2,41.3 59.56,35.94 60.8,35.94 63.22,33.53 JP1.4 JP1.2
GATE_1
  Top 0.305: IC1.5 70.37,76.69 70.1,76.96 68.71,76.96 68.42,76.68 IC1.2 68.42,75.06 65.91,72.55 X19.1
GATE_2
  Top 0.305: IC1.13 68.42,80.55 68.71,80.26 70.1,80.26 70.37,80.53 70.37,80.64 | 70.37,80.64 IC1.10 | 70.37,80.64 75.31,75.71 X20.1
GATE_3
  Top 0.305: X21.1 84.71,72.01 83.12,73.6 82.18,74.53 IC3.5 82.18,76.57 81.79,76.96 80.52,76.96 80.23,76.68 IC3.2
GATE_4
  Top 0.305: X22.1 94.11,74.04 93.09,75.06 87.38,75.06 82.18,80.25 82.18,80.64 | 82.18,80.64 IC3.10 | IC3.13 80.23,80.67 80.64,80.26 81.8,80.26 82.18,80.64
GATE_5
  Top 0.305: IC4.5 70.37,19.16 70.1,19.43 68.71,19.43 68.42,19.15 IC4.2 68.42,16.38 67.74,15.7 67.74,15.67 65.91,13.84 X23.1
GATE_6
  Top 0.305: IC4.13 68.42,23.27 68.71,22.99 70.1,22.99 70.37,23.26 | 70.37,23.26 IC4.10 | 70.37,23.26 70.64,22.99 71.75,22.99 75.31,19.43 X24.1
GATE_7
  Top 0.305: IC5.5 82.18,19.16 81.92,19.43 80.49,19.43 80.23,19.18 IC5.2 80.23,11.97 81.79,10.41 X25.1
GATE_8
  Top 0.305: IC5.13 80.26,24.05 80.26,22.23 80.9,21.59 82.18,21.59 | X26.1 94.11,13.97 91.19,16.89 86.87,16.89 82.18,21.57 82.18,21.59 | 82.18,21.59 IC5.10
GND  (via drill 0.6)
  other vias: 72.64,17.53 52.2,78.74 44.2,85.98 52.45,69.72 43.18,69.85 42.8,78.87 35.18,85.98 33.78,69.98 33.4,78.74 25.78,85.98 24.26,78.74 24.51,70.1 16.51,85.98 14.48,74.1 15.11,65.28 15.24,55.88 14.99,45.72 14.48,36.7 14.73,28.7 15.24,18.67 15.37,22.86 22.35,15.62 16.89,30.86 31.75,15.75 24.64,22.73 33.91,22.86 41.02,15.75 43.31,22.86 50.42,15.75 61.34,62.61 61.59,54.86 61.72,46.48 62.87,40.51 25.27,32.89 34.42,32.89 43.43,32.64 25.91,30.23 35.18,30.23 44.58,30.1 69.72,41.78 68.83,51.94 69.72,49.28 69.72,34.54 68.83,57.91 97.79,76.96 72.64,88.65 62.36,88.65 63.63,79.25 75.56,79.25 83.69,88.65 97.79,19.56 83.95,17.14 88.52,19.05 81.66,51.94 81.66,59.82
  pour Bottom: 0,100 0,0 100,0 100,100
  pour Top: 0,100 0,0 100,0 100,100
HVM  (via drill 0.7)
  Top 0.559: R47.1 D4.A 73.41,54.63 73.41,52.2 | 73.41,52.2 C4.1 73.41,50.16 | SV1.8 SV1.7 | SV1.8 SV1.6 SV1.5 SV1.7 | SV1.8 SV1.10 SV1.9 SV1.7 | 73.41,50.16 73.41,48.96 C26.1 | 73.41,50.16 70.16,50.16 70.11,50.21 69.34,50.21 69.29,50.16 61.09,50.16 v60.07,51.18 | C65.1 73.54,52.07 73.41,52.2
  VDDM 0.559: v60.07,51.18 60.07,52.58 58.93,53.72 57.31,53.72 57.26,53.77 32.56,53.77 SV1.6
HVP
  Top 0.559: C25.1 73.41,57.08 C3.1 | C3.1 73.41,62.26 D2.C 71.14,62.48 LED2.A 71.14,61.6 69.63,61.6 69.43,61.4 65.09,61.4 56.77,53.09 SV3.9 | SV3.9 SV3.10 SV3.8 | SV3.7 SV3.8 | SV3.9 SV3.7 | SV3.7 SV3.5 SV3.6 SV3.8 | C64.1 C3.1
HVP_1
  Top 0.559: D2.A 78.89,64.14 85.34,64.14 P3.1
IN1_0  (via drill 0.55)
  Top 0.305: IC1.3 69.07,74.32 v69,74.24 | JP4.1 56.01,95 56.01,93.09 59.92,89.17 59.92,74.06 59.82,73.96 | SV4.1 56.64,62.74 59.82,65.91 59.82,72.9 59.82,73.96 | v59.82,74.04 59.82,73.96
  VDDM 0.305: v59.82,74.04 60.01,74.24 v69,74.24
IN1_1  (via drill 0.55)
  Top 0.305: IC1.6 71.02,74.52 v71.25,74.3 | SV4.2 55.37,60.2 60.71,65.53 v60.71,75.18 60.71,87.25 | JP4.2 60.71,90.04 60.71,87.25 | 60.71,87.25
  VDDM 0.305: v71.25,74.3 71.21,74.3 70.43,75.08 60.81,75.08 v60.71,75.18
IN2_0  (via drill 0.55)
  Top 0.305: JP4.3 53.34,94.87 53.34,93.34 57.87,88.82 v57.87,83.52 57.87,66.88 55.25,64.27 49.91,64.27 49.15,63.51 SV4.3 | IC1.11 69.72,82.33 69.87,82.48 69.87,83.21 v70.36,83.69
  VDDM 0.305: v70.36,83.69 58.04,83.69 v57.87,83.52
IN2_1  (via drill 0.55)
  Top 0.305: SV4.4 50.42,61.47 50.42,62.98 51.25,63.81 56.19,63.81 58.85,66.47 v58.85,84.63 58.85,89.36 JP4.4 | IC1.8 71.67,82.34 v73.03,83.69
  VDDM 0.305: v58.85,84.63 72.09,84.63 v73.03,83.69
IN3_0  (via drill 0.55)
  Top 0.305: v80.26,74.17 80.88,74.79 IC3.3 | JP4.5 50.8,94.87 50.8,93.47 51.05,93.22 51.05,93.18 51.65,92.58 51.69,92.58 55.6,88.67 v55.6,76.2 55.6,67.29 53.71,65.39 48.73,65.39 46.61,63.28 SV4.5
  VDDM 0.305: v80.26,74.17 74.3,74.17 72.26,76.2 v55.6,76.2
IN3_1  (via drill 0.55, 0.6)
  Top 0.305: SV4.6 47.88,61.47 47.88,63.2 49.61,64.94 54.39,64.94 56.77,67.31 v56.77,77.47 56.77,88.9 JP4.6 | IC3.6 82.83,76.14 83.47,76.78 v84.07,76.78
  VDDM 0.305: v56.77,77.47 62.36,77.47 63.04,76.78 v84.07,76.78
IN4_0  (via drill 0.6)
  Top 0.305: SV4.7 44.07,62.79 47.89,66.61 52.13,66.61 53.34,67.82 v53.34,80.26 53.34,88.77 49.66,92.46 48.9,92.46 48.39,92.96 48.39,95.63 48.9,96.14 JP4.7 | IC3.11 81.53,82.3 81.92,82.68 v82.04,82.68
  VDDM 0.305: v82.04,82.68 79.63,80.26 v53.34,80.26
IN4_1  (via drill 0.6)
  Top 0.305: SV4.8 45.34,61.47 45.34,63.1 48.28,66.04 52.96,66.04 54.48,67.56 v54.48,78.36 54.48,88.65 JP4.8 | IC3.8 83.48,80.6 84.45,79.63 v84.96,79.63
  VDDM 0.305: v84.96,79.63 83.69,78.36 80.08,78.36 80.04,78.4 79.37,78.4 79.33,78.36 68.29,78.36 68.27,78.38 67.62,78.38 67.6,78.36 v54.48,78.36
IN5_0  (via drill 0.55)
  Top 0.305: v69.21,16.51 69.07,16.64 IC4.3 | JP5.1 48.51,6.35 48.51,8.89 52.92,13.29 v52.92,19.3 52.92,32.26 51.34,33.83 49.34,33.83 49.01,34.16 47.75,34.16 46.55,35.37 46.04,35.37 SV2.7
  VDDM 0.305: v69.21,16.51 68.83,16.13 56.09,16.13 v52.92,19.3
IN5_1  (via drill 0.55)
  Top 0.305: IC4.6 71.02,17.24 v71.63,16.64 | SV2.8 45.34,38.61 45.34,37.08 46.35,36.07 46.86,36.07 48.07,34.86 48.96,34.86 49.53,34.29 52.45,34.29 54.12,32.62 v54.12,20.95 54.12,13.1 49.53,8.51 JP5.2
  VDDM 0.305: v71.63,16.64 70.87,17.4 57.67,17.4 v54.12,20.95
IN6_0  (via drill 0.55)
  Top 0.305: JP5.3 51.05,6.35 51.05,8.64 55.27,12.86 v55.27,28.26 55.27,33.5 53.98,34.8 49.91,34.8 49.21,35.5 48.45,35.5 SV2.9 | v69.47,28.07 69.72,27.81 IC4.11
  VDDM 0.305: v69.47,28.07 69.27,28.26 v55.27,28.26
IN6_1  (via drill 0.55)
  Top 0.305: SV2.10 47.88,38.61 47.88,36.96 48.56,36.27 49.2,36.27 50.04,35.43 50.4,35.43 50.47,35.36 55.24,35.36 56.45,34.15 v56.45,29.34 56.45,12.26 JP5.4 | IC4.8 71.67,27.48 v72.26,28.07
  VDDM 0.305: v56.45,29.34 69.6,29.34 70.87,28.07 v72.26,28.07
IN7_0  (via drill 0.55)
  Top 0.305: JP5.5 54.48,5.33 53.47,6.35 53.47,8.51 54.1,9.14 54.74,9.14 57.72,12.13 v57.72,14.99 57.72,34.35 56.14,35.94 52.44,35.94 52.32,35.81 50.66,35.81 49.96,36.51 49.96,36.52 SV2.11 | IC5.3 80.88,17.35 80.75,17.21 80.75,16.15 v81.15,15.75
  VDDM 0.305: v57.72,14.99 58.23,15.49 80.9,15.49 v81.15,15.75
IN7_1  (via drill 0.55)
  Top 0.305: IC5.6 82.83,16.16 v82.68,16 | SV2.12 50.42,38.61 50.42,36.7 50.55,36.58 50.94,36.58 51.25,36.27 52.13,36.27 52.44,36.58 56.39,36.58 59.09,33.88 v59.09,14.64 59.09,12.35 JP5.6
  VDDM 0.305: v82.68,16 82.68,15.75 81.64,14.71 59.16,14.71 v59.09,14.64
IN8_0  (via drill 0.55)
  Top 0.305: JP5.7 56.01,6.48 56.01,8.26 60.2,12.45 v60.2,26.04 60.2,33.66 56.52,37.34 SV2.13 | IC5.11 81.53,25.15 v81.66,25.27
  VDDM 0.305: v60.2,26.04 60.37,26.21 73.69,26.21 74.59,25.31 81.62,25.31 v81.66,25.27
IN8_1  (via drill 0.55)
  Top 0.305: JP5.8 61.59,12.32 v61.59,27.18 61.59,33.02 54.74,39.88 SV2.14 | IC5.8 83.48,24.81 v83.82,25.15
  VDDM 0.305: v61.59,27.18 73.79,27.18 74.74,26.23 78.43,26.23 78.66,26 79.84,26 80.06,26.23 82.74,26.23 v83.82,25.15
LVOUT1
  Top 0.305: SV4.10 42.8,61.47 42.8,63.75 44.64,65.6 C52.1
LVOUT1_LNA
  Top 0.305: 44.7,74.55 C53.1 | 44.7,74.55 R75.2 | U009.1 46.65,74.97 46.23,74.55 44.7,74.55
LVOUT1_LPF
  Top 0.305: C7.1 39.15,90.07 R4.2
  Top 0.406: X1.1 C7.1
LVOUT2
  Top 0.305: SV4.11 39.5,63.25 39.5,66.17 38.23,67.44 35.81,67.44 35.5,67.75 C30.1
LVOUT2_LNA
  Top 0.305: C31.1 35.31,74.55 | 35.31,74.55 R22.2 | U001.1 37.25,74.97 36.83,74.55 35.31,74.55
LVOUT2_LPF
  Top 0.305: R5.2 29.75,90.07 C8.1
  Top 0.406: C8.1 X2.1
LVOUT3
  Top 0.305: C34.1 26.36,67.88 29.21,65.02 36.83,65.02 37.85,64.01 37.85,60.71 38.35,60.2 SV4.12
LVOUT3_LNA
  Top 0.305: C35.1 26.04,74.55 | 26.04,74.55 R28.2 | U002.1 27.98,74.97 27.56,74.55 26.04,74.55
LVOUT3_LPF
  Top 0.305: R6.2 20.36,90.07 C9.1
  Top 0.406: C9.1 X3.1
LVOUT4
  Top 0.305: C46.1 16.96,67.88 22.1,62.74 SV4.13
LVOUT4_LNA
  Top 0.305: R34.2 16.76,74.55 | 16.76,74.55 C47.1 | U003.1 18.71,74.97 18.29,74.55 16.76,74.55
LVOUT4_LPF
  Top 0.305: C10.1 13.3,90.1 R7.2
  Top 0.406: C10.1 X4.1
LVOUT5
  Top 0.305: SV2.2 23.88,39.88 22.54,38.54 22.54,35.56 | 22.54,35.56 C38.1 | PAD5.1 22.54,35.56
LVOUT5_LNA
  Top 0.305: R40.2 22.61,26.92 | 22.61,26.92 C39.1 | U004.1 20.66,26.25 21.34,26.92 22.61,26.92
LVOUT6
  Top 0.305: C42.1 31.81,35.56 | 31.81,35.56 31.81,37.02 33.27,38.48 38.1,38.48 38.99,37.59 SV2.3 | PAD6.1 31.81,35.56
LVOUT6_LNA
  Top 0.305: C43.1 31.88,27.05 | 31.88,27.05 R48.2 | U005.1 29.93,26.12 30.86,27.05 31.88,27.05
LVOUT7
  Top 0.305: C50.1 41.08,33.98 40.26,34.8 | SV2.4 40.26,38.61 40.26,34.8 | PAD7.1 40.26,34.8
LVOUT7_LNA
  Top 0.305: R54.2 41.15,27.05 | 41.15,27.05 C51.1 | U006.1 39.2,26.38 39.88,27.05 41.15,27.05
LVOUT8
  Top 0.305: SV2.5 PAD8.1 44.32,34.54 46.48,34.54 47.71,33.31 49.42,33.31 C58.1
LVOUT8_LNA
  Top 0.305: R60.2 50.55,26.92 | 50.55,26.92 C59.1 | U007.1 48.6,26.5 49.02,26.92 50.55,26.92
LVOUT_1
  Top 0.305: U009.7 47.3,84.83 R79.2 48.39,86.87 47.88,87.38 41.94,87.38 R4.1
LVOUT_2
  Top 0.305: R25.2 39.15,85.82 | 39.15,85.82 38.01,84.68 38.01,83.24 37.9,83.13 U001.7 | 39.15,85.82 39.15,86.87 39.01,87.01 38.37,87.01 38.18,87.2 38.15,87.22 R5.1
LVOUT_3
  Top 0.305: U002.7 28.63,84.7 R31.2 29.84,86.89 29.73,87.01 28.84,87.01 28.65,87.2 28.62,87.22 R6.1
LVOUT_4
  Top 0.305: U003.7 19.36,84.7 R37.2 20.57,86.55 20.07,87.06 18.63,87.06 18.46,87.22 R7.1
LVOUT_5
  Top 0.305: U004.7 20.01,18.73 19.6,18.31 19.6,16.81 18.54,15.76 R43.2
  Top 0.406: PAD9.1 18.48,15.62 R43.2
LVOUT_6
  Top 0.305: R51.2 28.51,15.69 28.96,16.13 28.96,18.67 29.28,18.99 U005.7
  Top 0.406: R51.2 27.62,15.49 PAD10.1
LVOUT_7
  Top 0.305: U006.7 38.55,18.6 38.31,18.36 38.31,15.96 38.04,15.69 R57.2
  Top 0.406: R57.2 37.02,15.49 PAD11.1
LVOUT_8
  Top 0.305: U007.7 47.95,18.6 47.71,18.36 47.71,16.31 47.09,15.69
  Top 0.406: 47.09,15.69 R63.2 46.29,15.49 PAD12.1
N$1
  Top 0.559: R2.2 LED1.C
N$2
  Top 0.559: LED2.C 68.3,62.61 R3.2
N$3  (via drill 0.6)
  Top 0.305: U001.6 38.55,82.42 39.21,83.08 39.21,83.98 R25.1 41.08,84.01 v41.15,83.95 | R26.1 33.46,81.85 v33.4,81.79
  Bottom 0.305: v33.4,81.79 38.99,81.79 v41.15,83.95
N$4
  Top 0.305: U001.3 38.55,74.41 R70.1 R24.2
N$5
  Top 0.305: U001.2 37.9,73.78 R23.1 35.56,71.44 R22.1
N$6
  Top 0.305: C30.2 37.4,71.37 R23.2
N$7
  Top 0.305: R26.2 C31.2
N$8
  Top 0.305: U001.5 39.2,81.24 39.81,81.85 R27.2
N$9  (via drill 0.6)
  Top 0.305: U002.6 29.28,82.24 29.84,82.8 R31.1 29.91,84.07 v31.62,84.07 | R32.1 24.32,81.85 v24.26,81.79
  Bottom 0.305: v24.26,81.79 29.34,81.79 v31.62,84.07
N$10  (via drill 0.6)
  other vias: 15.11,81.22
N$11
  Top 0.559: LED3.C R46.2
N$12
  Top 0.559: LED4.C 68.9,54.86 R47.2
N$13
  Top 0.559: D3.C P2.2
N$14
  Top 0.559: P4.2 77.49,54.36 D4.C
N$15
  Top 0.305: U002.3 29.28,74.41 R71.1 R30.2
N$16  (via drill 0.6)
  Top 0.305: U004.6 19.36,19.36 18.54,18.54 R43.1 16.83,17.59 v16.76,17.65 | v23.11,18.03 22.61,18.54 R44.1
  Bottom 0.305: v16.76,17.65 17.14,18.03 v23.11,18.03
N$17
  Top 0.305: R42.2 19.36,27.06 U004.3
N$18
  Top 0.305: U004.2 20.01,27.7 R41.1 22.35,30.03 R40.1
N$19
  Top 0.305: C38.2 20.64,30.23 R41.2
N$20
  Top 0.305: C39.2 R44.2
N$21
  Top 0.305: U004.5 18.71,19.6 18.41,19.3 17.34,19.3 R45.2
N$22  (via drill 0.6)
  Top 0.305: U005.6 28.63,19.56 27.81,18.74 R51.1 27.75,17.53 v25.91,17.53 | R52.1 31.88,18.8 v32.51,18.16
  Bottom 0.305: v25.91,17.53 26.54,18.16 v32.51,18.16
N$23
  Top 0.305: U002.2 28.63,73.78 R29.1 26.29,71.44 R28.1
N$24
  Top 0.305: R29.2 28.25,71.38 C34.2
N$25
  Top 0.305: R32.2 C35.2
N$26
  Top 0.305: U002.5 29.93,81.75 30.1,81.92 31.68,81.92 R33.2
N$27  (via drill 0.6)
  Top 0.305: U003.6 20.01,82.11 20.57,82.68 R37.1 20.64,83.95 v22.48,83.95 | R38.1 16.19,82.42 v15.11,82.42
  Bottom 0.305: v15.11,82.42 20.95,82.42 v22.48,83.95
N$28
  Top 0.305: U003.3 20.01,74.41 R72.1 R36.2
N$29
  Top 0.305: U003.2 19.36,73.78 R35.1 17.02,71.44 R34.1
N$30
  Top 0.305: R35.2 18.92,68.9 C46.2
N$31
  Top 0.305: R38.2 C47.2
N$32
  Top 0.305: R39.2 20.89,81.85 20.66,81.62 U003.5
N$33
  Top 0.305: R50.2 27.56,27.3 28.63,26.23 U005.3
N$34
  Top 0.305: U005.2 29.28,27.82 R49.1 31.62,30.16 R48.1
N$35
  Top 0.305: C42.2 29.72,32.32 R49.2
N$36
  Top 0.305: C43.2 R52.2
N$37
  Top 0.305: R53.2 27.75,19.75 27.98,19.98 U005.5
N$38  (via drill 0.6)
  Top 0.305: U006.6 37.9,19.36 37.21,18.67 R57.1 35.37,17.59 v35.31,17.53 | R58.1 41.15,18.8 v41.91,18.03
  Bottom 0.305: v35.31,17.53 35.81,18.03 v41.91,18.03
N$39
  Top 0.305: R56.2 37.9,27.19 U006.3
N$40
  Top 0.305: R54.1 39.25,28.26 R55.1 38.55,27.82 U006.2
N$41
  Top 0.305: C50.2 39.18,30.35 R55.2
N$42
  Top 0.305: C51.2 R58.2
N$43
  Top 0.305: R59.2 36.9,19.75 37.25,20.11 U006.5
N$44  (via drill 0.6)
  Top 0.305: U007.6 47.3,19.3 46.48,18.49 R63.1 46.42,17.53 v44.58,17.53 | R64.1 50.55,18.92 v51.44,18.03
  Bottom 0.305: v44.58,17.53 45.09,18.03 v51.44,18.03
N$45
  Top 0.305: R62.2 46.23,27.18 47.3,26.11 U007.3
N$46
  Top 0.305: R60.1 48.65,28.13 R61.1 47.95,27.7 U007.2
N$47
  Top 0.305: C58.2 48.58,30.23 R61.2
N$48
  Top 0.305: C59.2 R64.2
N$49
  Top 0.305: R65.2 46.42,19.75 46.65,19.98 U007.5
N$50
  Top 0.305: R69.2 49.02,69.02 C63.2
N$51
  Top 0.305: R71.2 30.55,71.25 C67.2
N$52
  Top 0.305: C66.2 39.62,68.9 R70.2
N$54
  Top 0.305: C68.2 21.08,68.9 R72.2
N$58  (via drill 0.6)
  Top 0.305: R80.1 44.7,81.78 44.69,81.79 v42.8,81.79 | v50.29,83.95 50.23,84.01 R79.1 48.51,83.89 48.51,83.24 47.95,82.68 U009.6
  Bottom 0.305: v42.8,81.79 48.13,81.79 v50.29,83.95
N$59
  Top 0.305: U009.3 47.95,74.41 R69.1 R77.2
N$60
  Top 0.305: U009.2 47.3,74.17 46.86,73.73 R76.1 44.96,71.44 R75.1
N$61
  Top 0.305: R76.2 46.86,69.15 C52.2
N$62
  Top 0.305: C53.2 R80.2
N$63
  Top 0.305: U009.5 48.6,81.62 48.83,81.85 R81.2
RF1  (via drill 0.55)
  Top 0.305: IC1.1 67.77,77.42 v67.94,77.6 | v73.26,85.37 73.28,85.34 | 73.28,85.34 73.41,85.22 76.39,88.2 R21.2 80.28,84.76 86.44,84.76 89.36,81.83 | IC1.9 71.02,83.09 73.28,85.34
  Top 0.406: 89.36,81.83 IC2.1 | X18.1 76.71,88.97 R21.2
  Bottom 0.305: v67.94,77.6 67.94,83.95 69.36,85.37 v73.26,85.37
RF3  (via drill 0.6)
  Top 0.305: R66.2 91.31,84.9 91.31,80.9 90.95,80.53 IC2.3 87.87,80.53 v87.76,80.64 85.47,82.93 83.44,82.93 82.83,82.33 IC3.9 | v79.7,77.59 79.58,77.47 IC3.1
  Top 0.406: R66.2 87.5,88.71 X27.1
  VDDM 0.305: v79.7,77.59 84.7,77.59 v87.76,80.64
RF5  (via drill 0.6)
  Top 0.305: X28.1 81.72,30.03 R67.2 74.3,30.03 | IC6.1 87.84,23.16 85.07,25.93 82.37,25.93 82.11,26.18 81.46,26.18 81.19,25.91 75.82,25.91 75.56,26.16 74.3,27.43 74.3,30.03 | 74.3,30.03 71.94,30.03 v71.02,29.11 IC4.9 | IC4.1 67.77,19.77 68.25,20.24 v70.1,20.24
  Bottom 0.305: v71.02,29.11 71.02,21.11 70.15,20.24 v70.1,20.24
RF7  (via drill 0.6)
  Top 0.305: IC5.9 82.83,22.96 83.93,21.86 | 83.93,21.86 IC6.3 91.71,21.86 93.41,23.56 R68.2 | 83.93,21.86 83.93,21.61 v83.95,21.59 | v79.63,20.19 79.63,18.38 IC5.1
  Top 0.406: X29.1 93.41,29.91 R68.2
  VDDM 0.305: v83.95,21.59 82.8,20.45 79.88,20.45 v79.63,20.19
TEST_VIA_1
  Top 0.305: C63.1 50.73,67.75 50.42,67.44 46.61,67.44 PAD1.1
TEST_VIA_2
  Top 0.305: PAD2.1 41.59,66.87 C66.1
TEST_VIA_3
  Top 0.305: PAD3.1 32.45,66.74 C67.1
TEST_VIA_4
  Top 0.305: PAD4.1 23.05,66.74 C68.1
THSD
  Top 0.559: SV3.1 58.04,42.42 61.98,38.48 61.98,37.68 62.95,36.7 63.97,36.7 64.48,36.2 R1.1
VDDM  (via drill 0.6)
  Top 0.305: U009.4 48.6,75.48 48.77,75.31 50.23,75.31 C54.2 50.61,75.56 v52.2,75.56 | U001.4 39.2,75.48 39.37,75.31 40.83,75.31 C32.2 41.21,75.56 | C36.2 31.91,75.47 31.62,75.18 30.1,75.18 29.93,75.35 U002.4 | U003.4 20.66,75.48 20.83,75.31 22.16,75.31 22.38,75.53 C48.2 | C40.2 17.21,26.16 18.41,26.16 18.71,25.87 U004.4 | U005.4 27.98,25.99 27.81,26.16 26.48,26.16 C44.2 | C56.2 36.9,25.97 37.25,25.61 U006.4 | C60.2 46.42,25.97 46.65,25.74 U007.4
  Top 0.406: v33.4,75.44 31.94,75.44 31.91,75.47 | v42.8,75.56 41.21,75.56 | v24.26,75.44 22.48,75.44 22.38,75.53 | C40.2 16.89,27.3 v16.64,27.56 | v24.64,25.65 24.83,25.84 C44.2 | v33.91,25.91 33.97,25.97 C56.2 | C60.2 44.77,25.91 v43.31,25.91
  Top 0.559: R46.1 D3.A 73.51,44.96 | 73.51,44.96 73.51,43.66 C2.1 73.41,41.47 C24.1 | SV3.3 73.51,44.96
  pour VDDM: 0,100.08 0,0 0.89,0 99.95,0 99.95,1.14 99.95,100.08 97.92,100.08
VDDP  (via drill 0.55, 0.6)
  Top 0.305: IC1.14 67.77,82.59 67.56,82.8 65.91,82.8 65.66,82.55 C5.1 63.69,81.72 v63.63,81.66 | IC3.14 79.58,82.59 79.38,82.8 77.47,82.8 77.34,82.68 C27.1 75.5,81.72 v75.44,81.66 | U009.8 46.65,83.34 C55.1 | C33.1 37.25,83.72 U001.8 | C37.1 27.98,83.59 U002.8 | C49.1 18.71,83.59 U003.8 | U004.8 20.7,20.82 C41.1 | C45.1 29.93,17.75 U005.8 | C57.1 39.2,17.75 U006.8 | U007.8 48.6,17.75 C61.1 | IC6.14 95.73,23.18 C62.1 v97.79,25.02
  Top 0.406: IC4.14 67.77,24.56 67.44,24.89 65.66,24.89 65.28,24.51 C28.1 65.21,23.75 63.63,23.75 v63.5,23.88 | IC5.14 79.58,24.51 79.2,24.89 77.47,24.89 77.09,24.51 C29.1 76.77,23.37 v74.8,23.37 | v97.79,83.19 97.79,81.79 | 97.79,81.79 C6.1 | IC2.14 97.75,81.83 97.79,81.79 | v44.2,84.33 44.51,84.01 C55.1 | v35.18,84.07 36.9,84.07 C33.1 | v25.78,84.07 27.5,84.07 C37.1 | v16.51,84.07 18.23,84.07 C49.1 | v22.35,17.02 21.78,17.59 C41.1 | C45.1 31.31,17.59 v31.75,17.14 | C57.1 40.58,17.59 v41.02,17.14 | v50.42,17.14 49.98,17.59 C61.1
  Top 0.559: SV3.12 52.2,53.09 52.2,44.45 SV3.2 59.94,36.7 61.72,36.7 63.7,34.72 67.67,34.72 68.01,35.05 R1.2 69.09,37.27 69.28,37.27 69.53,37.53 69.53,37.72 70.42,38.61 LED1.A D1.C 73.41,38.38 C1.1 73.41,33.85 C23.1
  pour VDDP: 0,0 100,0 100,100 0,100
VDDP_1
  Top 0.559: D1.A 79.52,40.89 84.96,40.89 P1.1
XDCR_1  (via drill 0.6)
  Top 0.305: X9.1 10.1,83.19 11.37,81.92 C15.1 11.42,81.99 11.42,79.34 R12.2 11.4,78.51 12.19,77.72 14.1,77.72 15.35,76.47 15.35,67.45 25.15,57.66 SV1.1
  Top 0.406: X5.1 10.92,10.64 R8.2 10.26,12.48 C11.1 10.92,13.78 v10.92,15.24
  VDDP 0.406: SV1.1 20.83,57.66 10.92,47.75 v10.92,15.24
XDCR_2  (via drill 0.6)
  Top 0.305: SV1.2 30.3,56.59 21.64,56.59 17.14,61.09 17.14,64.58 11.4,70.32 R13.2 11.37,72.55 C16.1 9.85,73.79 X10.1
  Top 0.406: X5.4 X5.3 X5.2 X5.5 13.46,10.95 R8.1 13.14,11.34 C11.2 13.46,13.78 v13.46,15.24
  VDDP 0.406: SV1.2 30.1,56.39 21.97,56.39 13.46,47.88 v13.46,15.24
XDCR_3  (via drill 0.6)
  Top 0.305: X11.1 11.24,64.39 11.37,64.26 | SV1.3 18.92,55.12 11.4,62.64 R14.2 11.37,63.66 11.37,64.26 | C17.1 11.37,64.26
  Top 0.406: v18.41,13.59 20.26,13.59 C12.1 19.41,12.48 R9.2 20.32,10.39 X6.1
  VDDP 0.406: SV1.3 23.37,55.12 20.32,52.07 20.32,15.49 v18.41,13.59
XDCR_4  (via drill 0.6)
  Top 0.305: X12.1 9.72,54.99 C18.1 11.37,54.14 R15.2 11.4,53.11 12.06,52.45 25.4,52.45 26.92,53.98 30.23,53.98 SV1.4
  Top 0.406: X6.4 X6.3 X6.2 X6.5 22.86,10.69 R9.1 22.29,11.34 C12.2 22.41,13.59 v24,13.59
  VDDP 0.406: SV1.4 29.97,53.72 24.89,53.72 24.07,52.9 24.07,26.3 23.78,26.01 23.78,22.38 24.07,22.09 24.07,13.65 v24,13.59
XDCR_5  (via drill 0.6)
  Top 0.305: X13.1 10.1,45.34 C19.1 | C19.1 11.37,47.82 11.81,48.26 25.53,48.26 SV1.11 | C19.1 11.37,43.98 R16.2
  Top 0.406: X7.1 29.31,6.76 R10.2 29.31,12.48 C13.1 v28.57,13.46
  VDDP 0.406: SV1.11 27.69,44.96 27.62,44.9 26.23,44.9 25.4,44.07 25.4,35.69 29.46,31.62 29.72,31.62 29.72,14.61 v28.57,13.46
XDCR_6  (via drill 0.6)
  Top 0.305: C20.1 11.31,37.66 11.31,37.97 | SV1.12 30.1,43.69 16.51,43.69 15.7,42.88 15.69,42.88 11.31,38.5 11.31,37.97 | R17.2 11.4,35.94 | 11.4,35.94 11.4,37.88 11.31,37.97 | X14.1 11.4,35.94
  Top 0.406: X7.4 X7.3 X7.2 X7.5 32.26,11.2 R10.1 32.19,11.34 C13.2 33.15,13.46 33.4,13.72 v33.4,15.11
  VDDP 0.406: SV1.12 30.1,43.69 27.81,43.69 26.92,42.8 26.92,37.21 32.61,31.53 32.61,22.61 33.4,21.81 v33.4,15.11
XDCR_7  (via drill 0.6)
  Top 0.305: SV1.13 16.83,42.42 15.53,41.12 15.53,32.29 14.73,31.5 12.38,31.5 11.37,30.48 C21.1 11.37,27.09 | 11.37,27.09 R18.2 | X15.1 10.82,26.54 11.37,27.09
  Top 0.406: X8.1 38.84,6.63 R11.2 38.84,12.48 C14.1 v38.1,13.46
  VDDP 0.406: SV1.13 28.83,41.02 38.1,31.75 v38.1,13.46
XDCR_8  (via drill 0.6)
  Top 0.305: SV1.14 30.23,41.27 18.51,41.27 16.24,39.01 16.24,31.35 15.65,30.77 15.65,25.11 11.37,20.83 C22.1 11.4,19.52 R19.2 11.28,17.14 X16.1
  Top 0.406: X8.4 X8.3 X8.2 X8.5 41.68,8.91 R11.1 41.72,11.34 C14.2 43.31,13.46 v43.56,13.72
  VDDP 0.406: SV1.14 31.37,40.26 42.04,29.59 42.04,22.23 42.8,21.46 42.8,14.48 v43.56,13.72
~RF1  (via drill 0.55, 0.6)
  Top 0.305: IC1.12 69.07,82.79 v69.09,82.8 | IC2.2 88.79,81.18 85.77,84.2 v75.69,84.2 | IC1.4 69.72,74.68 v70.1,74.3
  Bottom 0.305: v70.1,74.3 70.1,81.79 v69.09,82.8 74.3,82.8 v75.69,84.2
~RF3  (via drill 0.6)
  Top 0.305: IC2.4 88.39,79.88 88.01,79.5 v88.01,79.49 | IC3.4 81.53,74.3 v81.41,74.17 | IC3.12 80.88,82.44 v80.52,82.8
  VDDM 0.305: v88.01,79.49 82.69,74.17 v81.41,74.17
  Bottom 0.305: v80.52,82.8 80.52,75.06 v81.41,74.17
~RF5  (via drill 0.6)
  Top 0.305: IC4.12 69.07,25.16 v68.83,25.4 | IC6.2 87.35,22.51 v87.19,22.67 | IC4.4 69.72,17.4 70.36,16.76 v70.36,16.38
  VDDM 0.305: v68.83,25.4 73.66,25.4 74.91,24.15 80.44,24.15 80.46,24.14 82.28,24.14 82.29,24.15 85.7,24.15 v87.19,22.67
  Bottom 0.305: v68.83,25.4 68.83,17.91 69.45,17.29 69.53,17.29 69.99,16.83 69.99,16.75 v70.36,16.38
~RF7  (via drill 0.55, 0.6)
  Top 0.305: IC5.4 v81.53,16.89 | v87.25,21.05 87.41,21.21 IC6.4 | IC5.12 80.88,22.89 v81.38,22.4
  VDDM 0.305: v81.38,22.4 85.17,22.4 86.52,21.05 v87.25,21.05
  Bottom 0.305: v81.38,22.4 81.38,17.05 v81.53,16.89

### Text on the board
tNames: 4 | 3 | 2 | 1 | LVOUT | CLK | RF | 1+2 | 3+4 | IN 4-1 | GND | 1 | 1 | 2 | 2 | 3 | 4 | Gate | 3 | D4 | HVP | 4 | HVM | 5 | VDDM | VDDP | 6 | on | CW | off | 5+6 | 7+8 | 7 | 8 | 5 | 6 | 7 | 8 | Gate | HVOUT | 1 | 0 | STHV800 Pulser Board V10 | DIFF | 1+2 | 3+4 | 5+6 | 7+8 | IN 5-8 | 21 Sept 2020